# EAGLE design solohm (EAGLE 6.6.0)

## Sheet 1 of 4: CPU
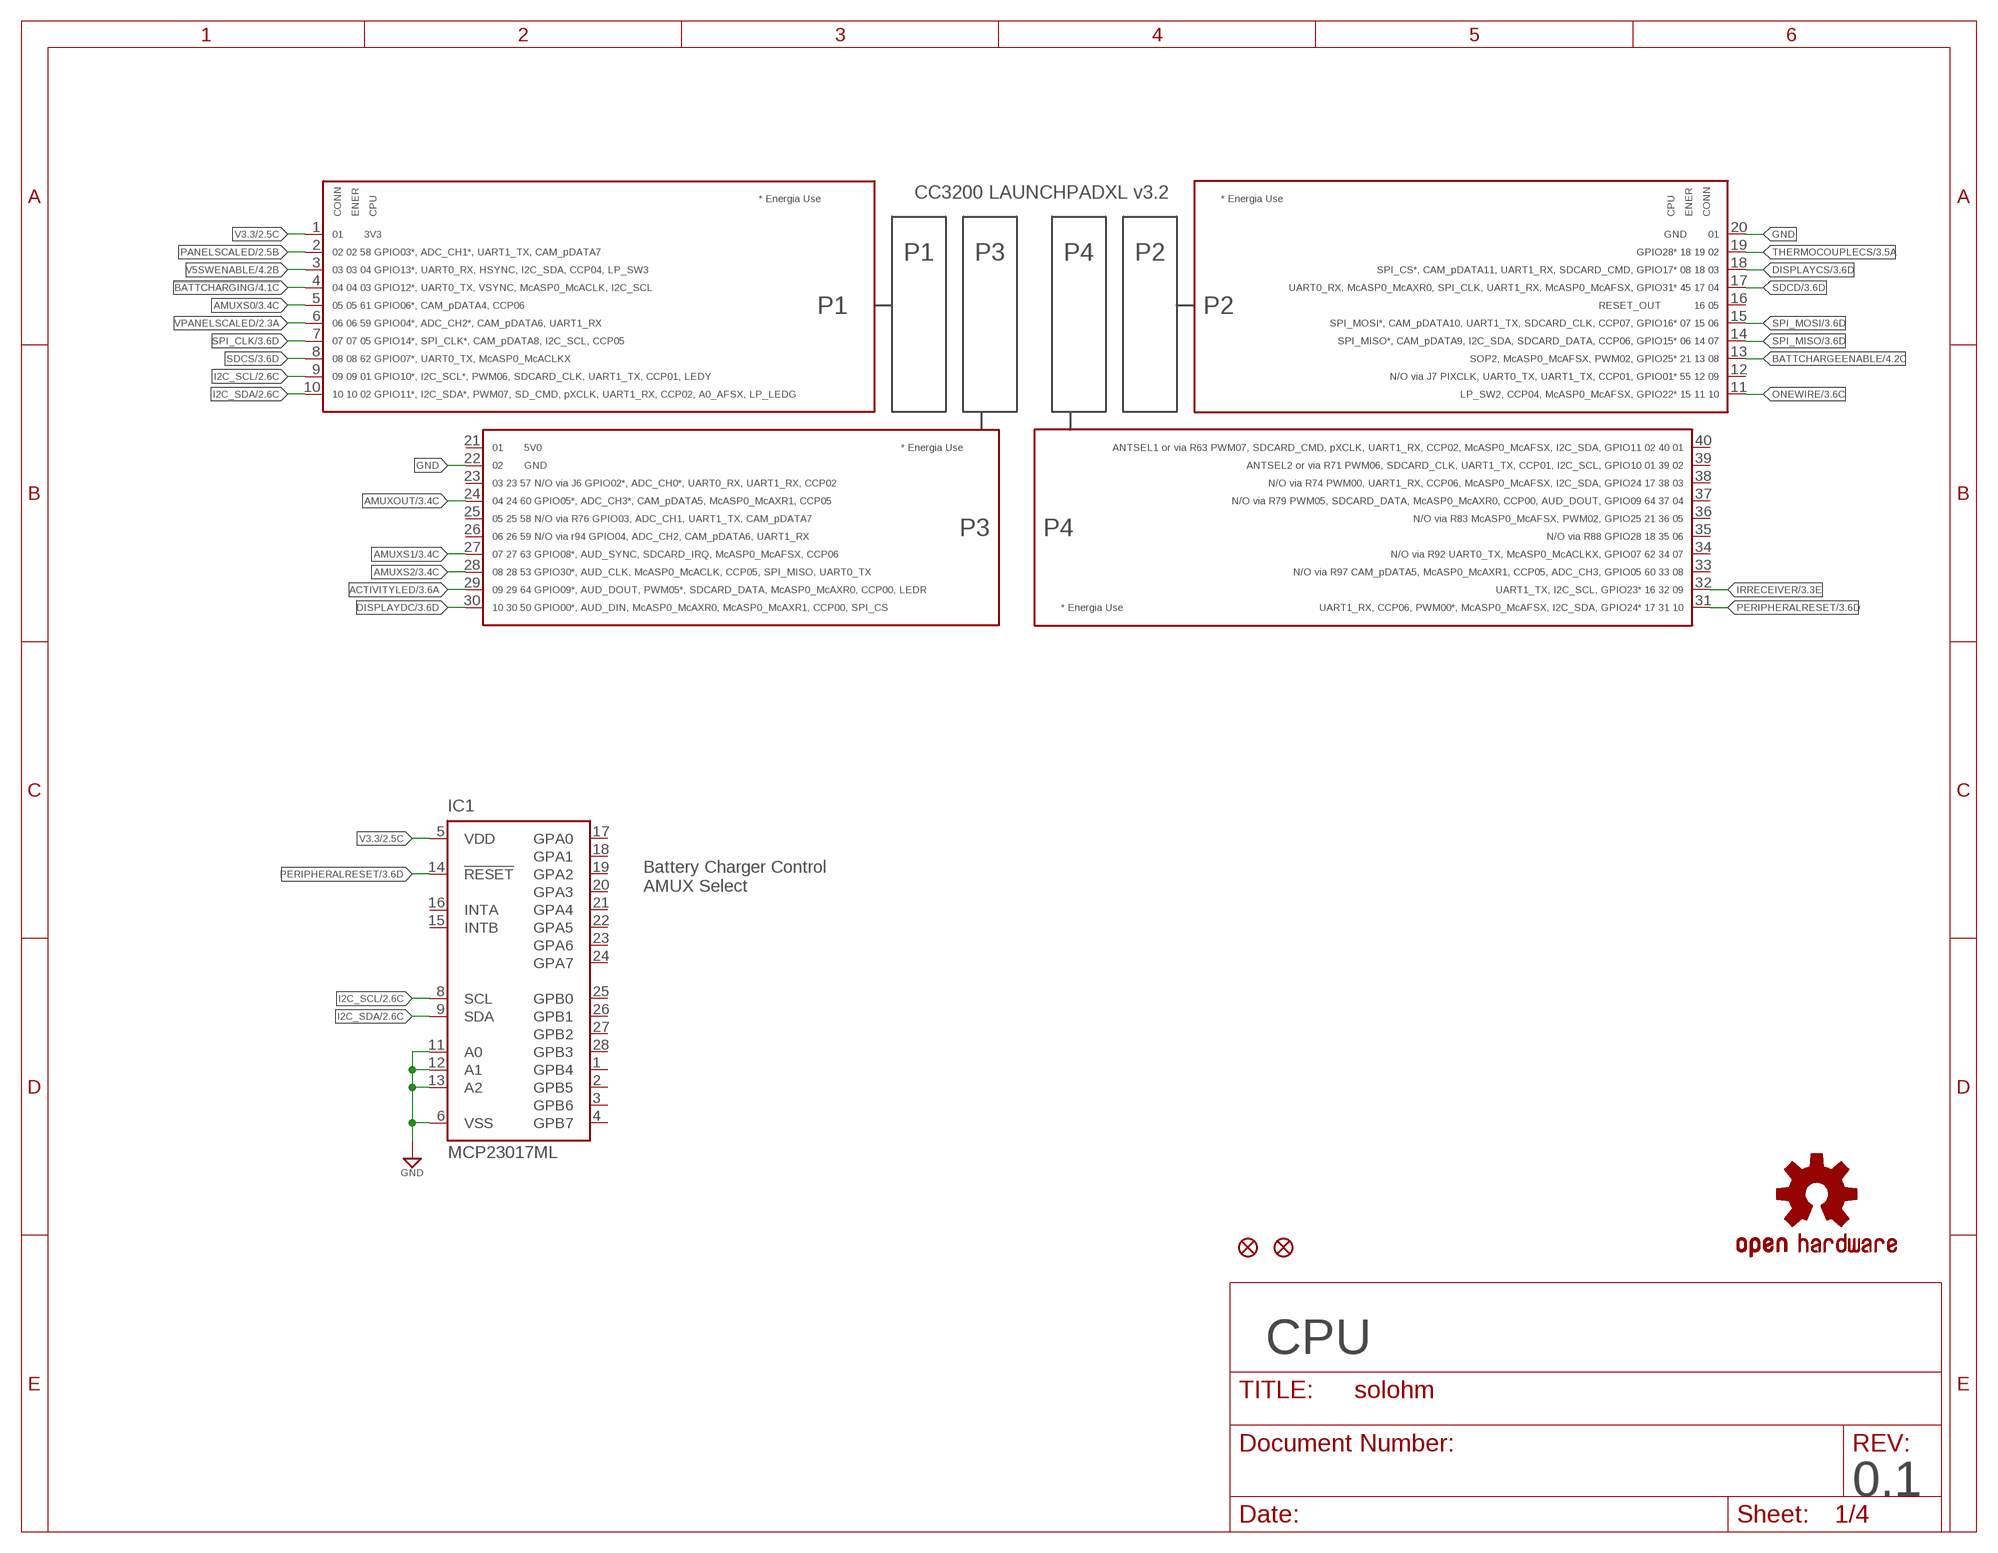
[diagram p0: schematic, sheet 1]

### Parts
A1  CC3200-LAUNCHXL-BOOSTERPACK  [CC3200-LAUNCHXL-BOOSTERPACK]
IC1  MCP23017ML  [QFN28-ML_6X6MM]
JP1  FIDUCIALUFIDUCIAL  [MICRO-FIDUCIAL]
JP2  FIDUCIALUFIDUCIAL  [MICRO-FIDUCIAL]
LOGO1  LOGO-OSHWL  [LOGO-OSHW-L]

### Nets
!BATTCHARGING: A1.4 ; also sheet 4
ACTIVITYLED: A1.29 ; also sheet 3
AMUXOUT: A1.24 ; also sheet 3
AMUXS0: A1.5 ; also sheet 3
AMUXS1: A1.27 ; also sheet 3
AMUXS2: A1.28 ; also sheet 3
BATTCHARGEENABLE: A1.13 ; also sheet 4
DISPLAYCS: A1.18 ; also sheet 3
DISPLAYDC: A1.30 ; also sheet 3
GND: A1.20 A1.22 IC1.6(VSS) IC1.11(A0) IC1.12(A1) IC1.13(A2) ; also sheet 2,3,4
I2C_SCL: A1.9 IC1.8(SCL) ; also sheet 2,3
I2C_SDA: A1.10 IC1.9(SDA) ; also sheet 2,3
IPANELSCALED: A1.2 ; also sheet 2
IRRECEIVER: A1.32 ; also sheet 3
ONEWIRE: A1.11 ; also sheet 3
PERIPHERALRESET: A1.31 IC1.14(!RESET) ; also sheet 3
SDCD: A1.17 ; also sheet 3
SDCS: A1.8 ; also sheet 3
SPI_CLK: A1.7 ; also sheet 3
SPI_MISO: A1.14 ; also sheet 3
SPI_MOSI: A1.15 ; also sheet 3
THERMOCOUPLECS: A1.19 ; also sheet 3
V3.3: A1.1 IC1.5(VDD) ; also sheet 2,3,4
V5SWENABLE: A1.3 ; also sheet 4
VPANELSCALED: A1.6 ; also sheet 2
Unconnected: A1.12 A1.16 A1.21 A1.23 A1.25 A1.26 A1.33 A1.34 A1.35 A1.36 A1.37 A1.38 A1.39 A1.40 IC1.1(GPB4) IC1.2(GPB5) IC1.3(GPB6) IC1.4(GPB7) IC1.15(INTB) IC1.16(INTA) IC1.17(GPA0) IC1.18(GPA1) IC1.19(GPA2) IC1.20(GPA3) IC1.21(GPA4) IC1.22(GPA5) IC1.23(GPA6) IC1.24(GPA7) IC1.25(GPB0) IC1.26(GPB1) IC1.27(GPB2) IC1.28(GPB3)

### Notes on the sheet
- Battery Charger Control
  AMUX Select
- CPU
- 0.1

## Sheet 2 of 4: Load and Gain
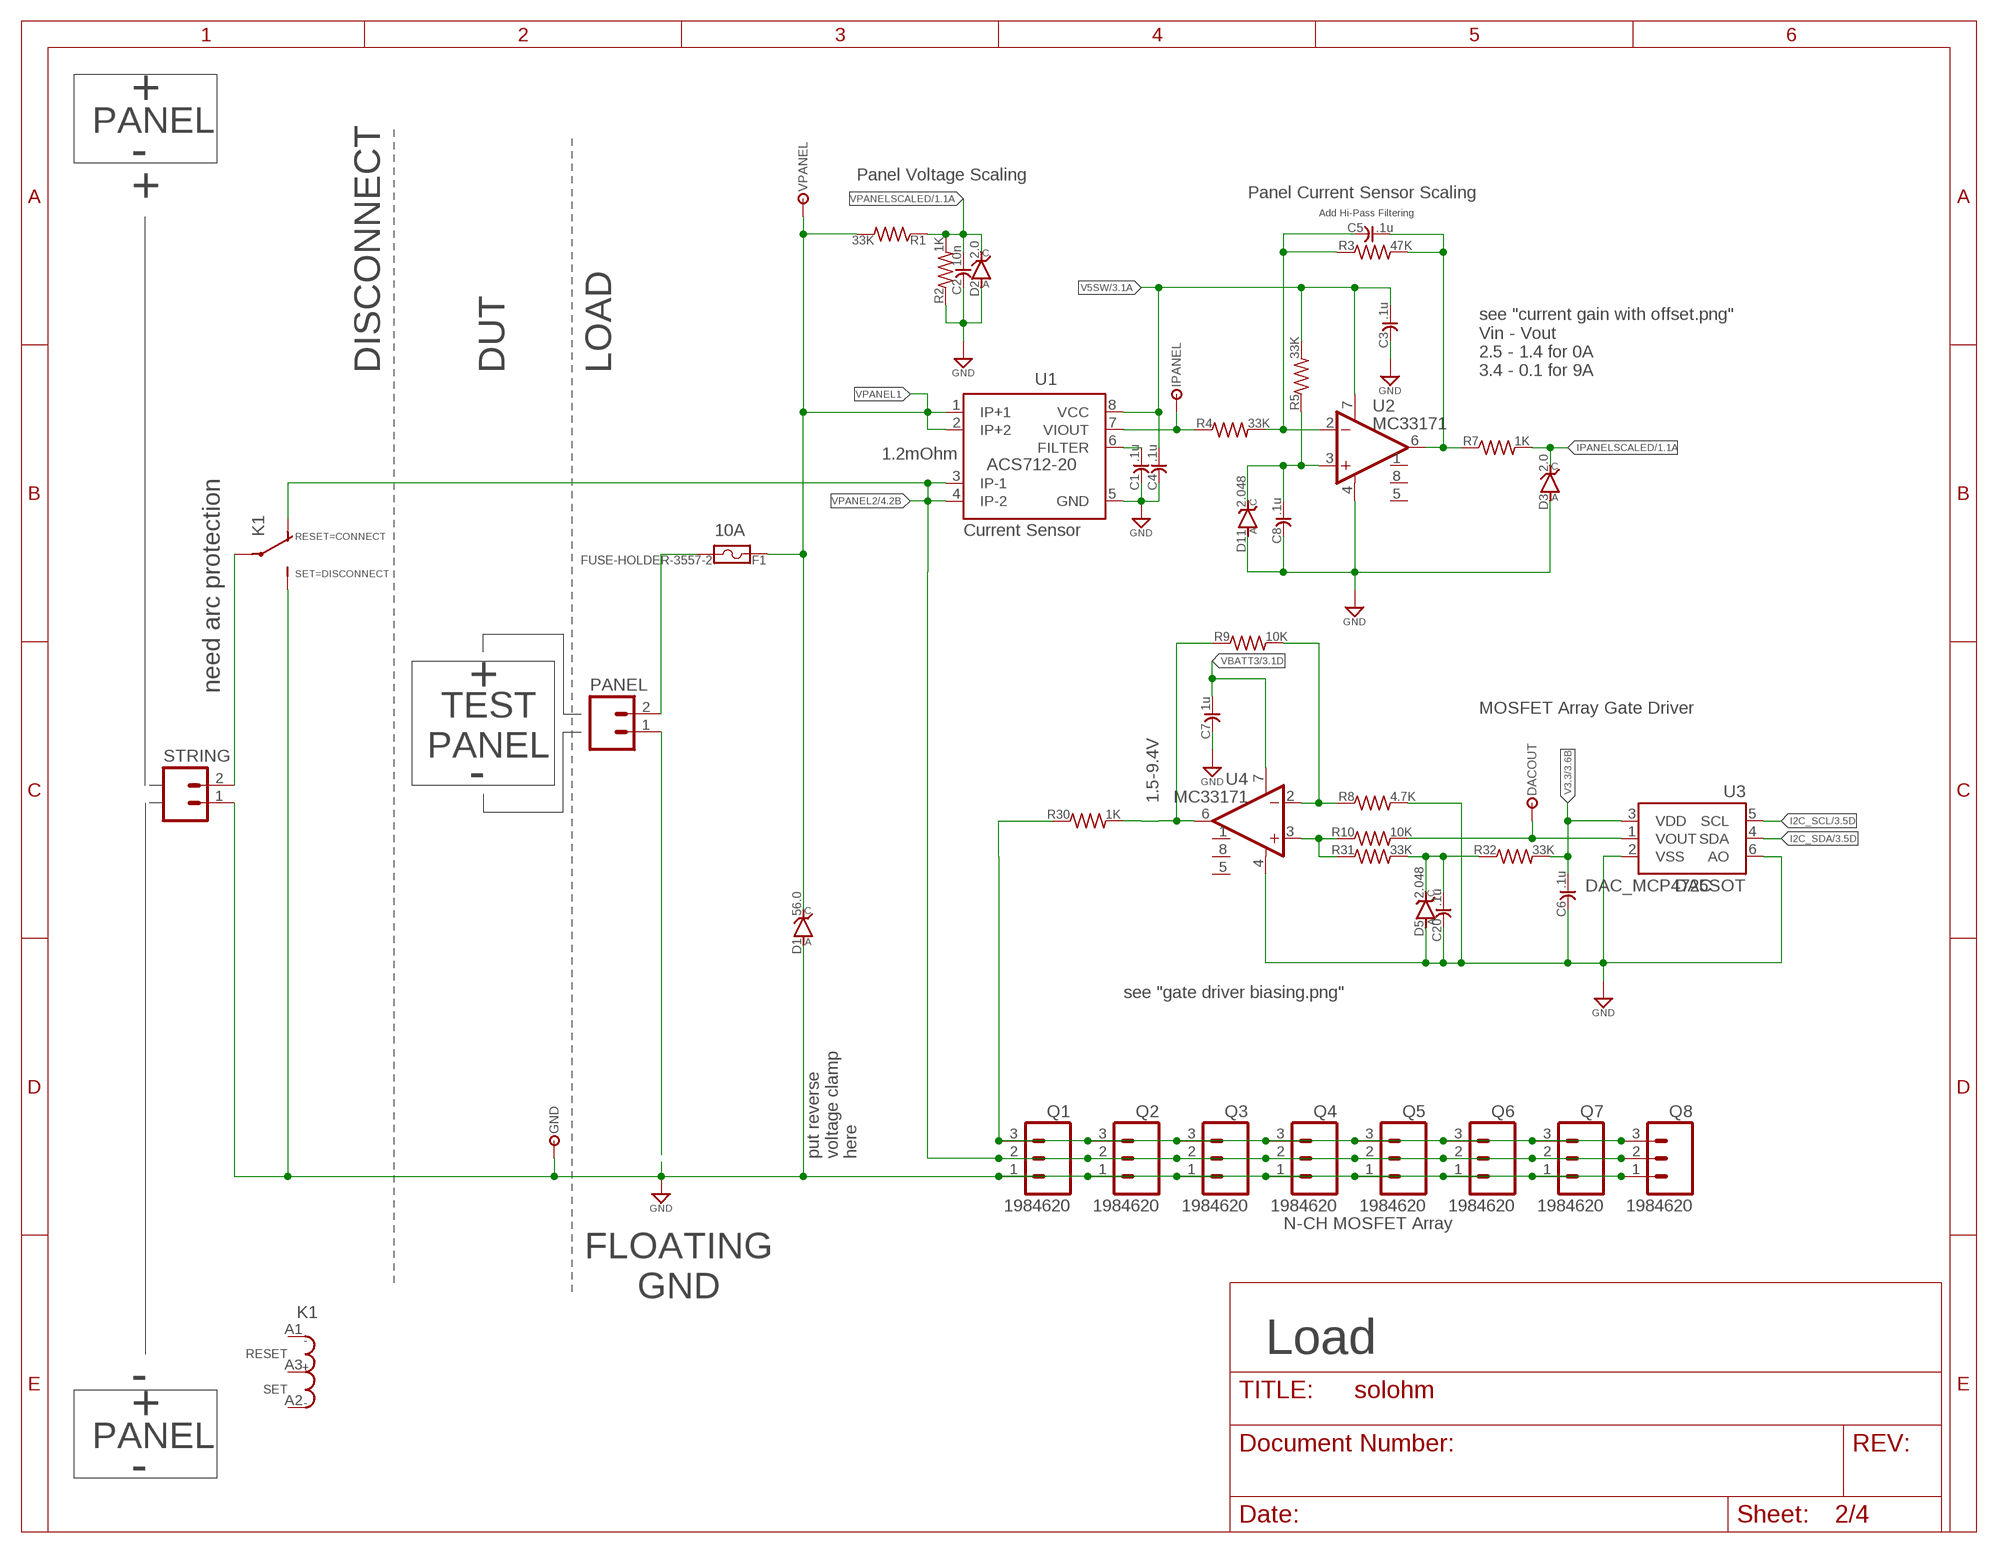
[diagram p1: schematic, sheet 2]

### Parts
C1  .1u  C-USC0603  [C0603]
C2  10n  C-USC0603  [C0603]
C3  .1u  C-USC0603  [C0603]
C4  .1u  C-USC0603  [C0603]
C5  .1u  C-USC0603  [C0603]
C6  .1u  C-USC0603  [C0603]
C7  1u  C-USC0603  [C0603]
C8  .1u  C-USC0603  [C0603]
C20  .1u  C-USC0603  [C0603]
D1  56.0  ZENER-SOD323  [SOD-323]
D2  2.0  ZENER-SOD323  [SOD-323]
D3  2.0  ZENER-SOD323  [SOD-323]
D5  2.048  ZENER-3TERM-SOT23-3  [SOT23-3]
D11  2.048  ZENER-3TERM-SOT23-3  [SOT23-3]
DACOUT  TESTPOINTTHRU  [TPTHRU]
F1  FUSE-HOLDER-3557-2  [3557-2]
GND  TESTPOINTTHRU  [TPTHRU]
IPANEL  TESTPOINTTHRU  [TPTHRU]
K1  RELAY-LATCHING-DUAL-1FORMC-5MM-16A  [RELAY-1FORMC-5MM-16A]
PANEL  M02-6.35MM  [OSTT702]
Q1  1984620  [1984620]
Q2  1984620  [1984620]
Q3  1984620  [1984620]
Q4  1984620  [1984620]
Q5  1984620  [1984620]
Q6  1984620  [1984620]
Q7  1984620  [1984620]
Q8  1984620  [1984620]
R1  33K  R-US_R0603  [R0603]
R2  1K  R-US_R0603  [R0603]
R3  47K  R-US_R0603  [R0603]
R4  33K  R-US_R0603  [R0603]
R5  33K  R-US_R0603  [R0603]
R7  1K  R-US_R0603  [R0603]
R8  4.7K  R-US_R0603  [R0603]
R9  10K  R-US_R0603  [R0603]
R10  10K  R-US_R0603  [R0603]
R30  1K  R-US_R0603  [R0603]
R31  33K  R-US_R0603  [R0603]
R32  33K  R-US_R0603  [R0603]
STRING  M02-6.35MM  [OSTT702]
U1  20  ACS712  [SOIC08]
U2  MC33171  OPAMPLM-SO08  [SO08]
U3  DAC_MCP4725SOT  [SOT23-6]
U4  MC33171  OPAMPLM-SO08  [SO08]
VPANEL  TESTPOINTTHRU  [TPTHRU]

### Nets
GATES: Q1.3 Q2.3 Q3.3 Q4.3 Q5.3 Q6.3 Q7.3 Q8.3 R30.1
GND: C1.2 C2.2 C3.2 C4.2 C6.2 C7.2 C8.2 C20.2 D1.A D2.A D3.A D5.2(A) D11.2(A) GND.1 K1.14@1(-1:NO) K1.14@2(-1:NO) PANEL.1 Q1.1 Q2.1 Q3.1 Q4.1 Q5.1 Q6.1 Q7.1 Q8.1 R2.1 R8.2 STRING.1 U1.5(GND) U2.4(V-) U3.2(VSS) U3.6(AO) U4.4(V-) ; also sheet 1,3,4
I2C_SCL: U3.5(SCL) ; also sheet 1,3
I2C_SDA: U3.4(SDA) ; also sheet 1,3
IPANELSCALED: D3.C R7.2 ; also sheet 1
N$1: R9.1 R30.2 U4.6(OUT)
N$3: C20.1 D5.1(C) R31.2 R32.1
N$4: C1.1 U1.6(FILTER)
N$5: IPANEL.1 R4.1 U1.7(VIOUT)
N$6: C5.2 R3.1 R4.2 U2.2(IN-)
N$7: C8.1 D11.1(C) R5.1 U2.3(IN+)
N$8: C5.1 R3.2 R7.1 U2.6(OUT)
N$9: DACOUT.1 R10.2 U3.1(VOUT)
N$10: R8.1 R9.2 U4.2(IN-)
N$12: R10.1 R31.1 U4.3(IN+)
N$20: K1.11@1(-1:W) K1.11@2(-1:W) STRING.2
V3.3: C6.1 R32.2 U3.3(VDD) ; also sheet 1,3,4
V5SW: C3.1 C4.1 R5.2 U1.8(VCC) U2.7(V+) ; also sheet 3,4
VBATT3: C7.1 U4.7(V+) ; also sheet 3,4
VPANEL0: F1.2@1 F1.2@2 PANEL.2
VPANEL1: D1.C F1.1@1 F1.1@2 R1.2 U1.1(IP+1) U1.2(IP+2) VPANEL.1
VPANEL2: K1.12@1(-1:NC) K1.12@2(-1:NC) Q1.2 Q2.2 Q3.2 Q4.2 Q5.2 Q6.2 Q7.2 Q8.2 U1.3(IP-1) U1.4(IP-2) ; also sheet 4
VPANELSCALED: C2.1 D2.C R1.1 R2.2 ; also sheet 1
Unconnected: D5.3(NC) D11.3(NC) K1.A1 K1.A2 K1.A3 U2.1(ON1) U2.5(NC8) U2.8(ON5) U4.1(ON1) U4.5(NC8) U4.8(ON5)

### Notes on the sheet
- +
- PANEL
- -
- Panel Voltage Scaling
- + | Panel Current Sensor Scaling
- Add Hi-Pass Filtering
- DISCONNECT | DUT | LOAD
- see "current gain with offset.png"
  Vin - Vout
  2.5 - 1.4 for 0A
  3.4 - 0.1 for 9A
- 1.2mOhm
- 10A | Current Sensor
- RESET=CONNECT
- SET=DISCONNECT
- need arc protection | +
- MOSFET Array Gate Driver
- TEST
  PANEL
- -
- 1.5-9.4V
- DAC
- see "gate driver biasing.png"
- put reverse 
  voltage clamp
  here
- N-CH MOSFET Array
- FLOATING
  GND
- Load
- -
- +
- PANEL
- -

## Sheet 3 of 4: Sensors and UI
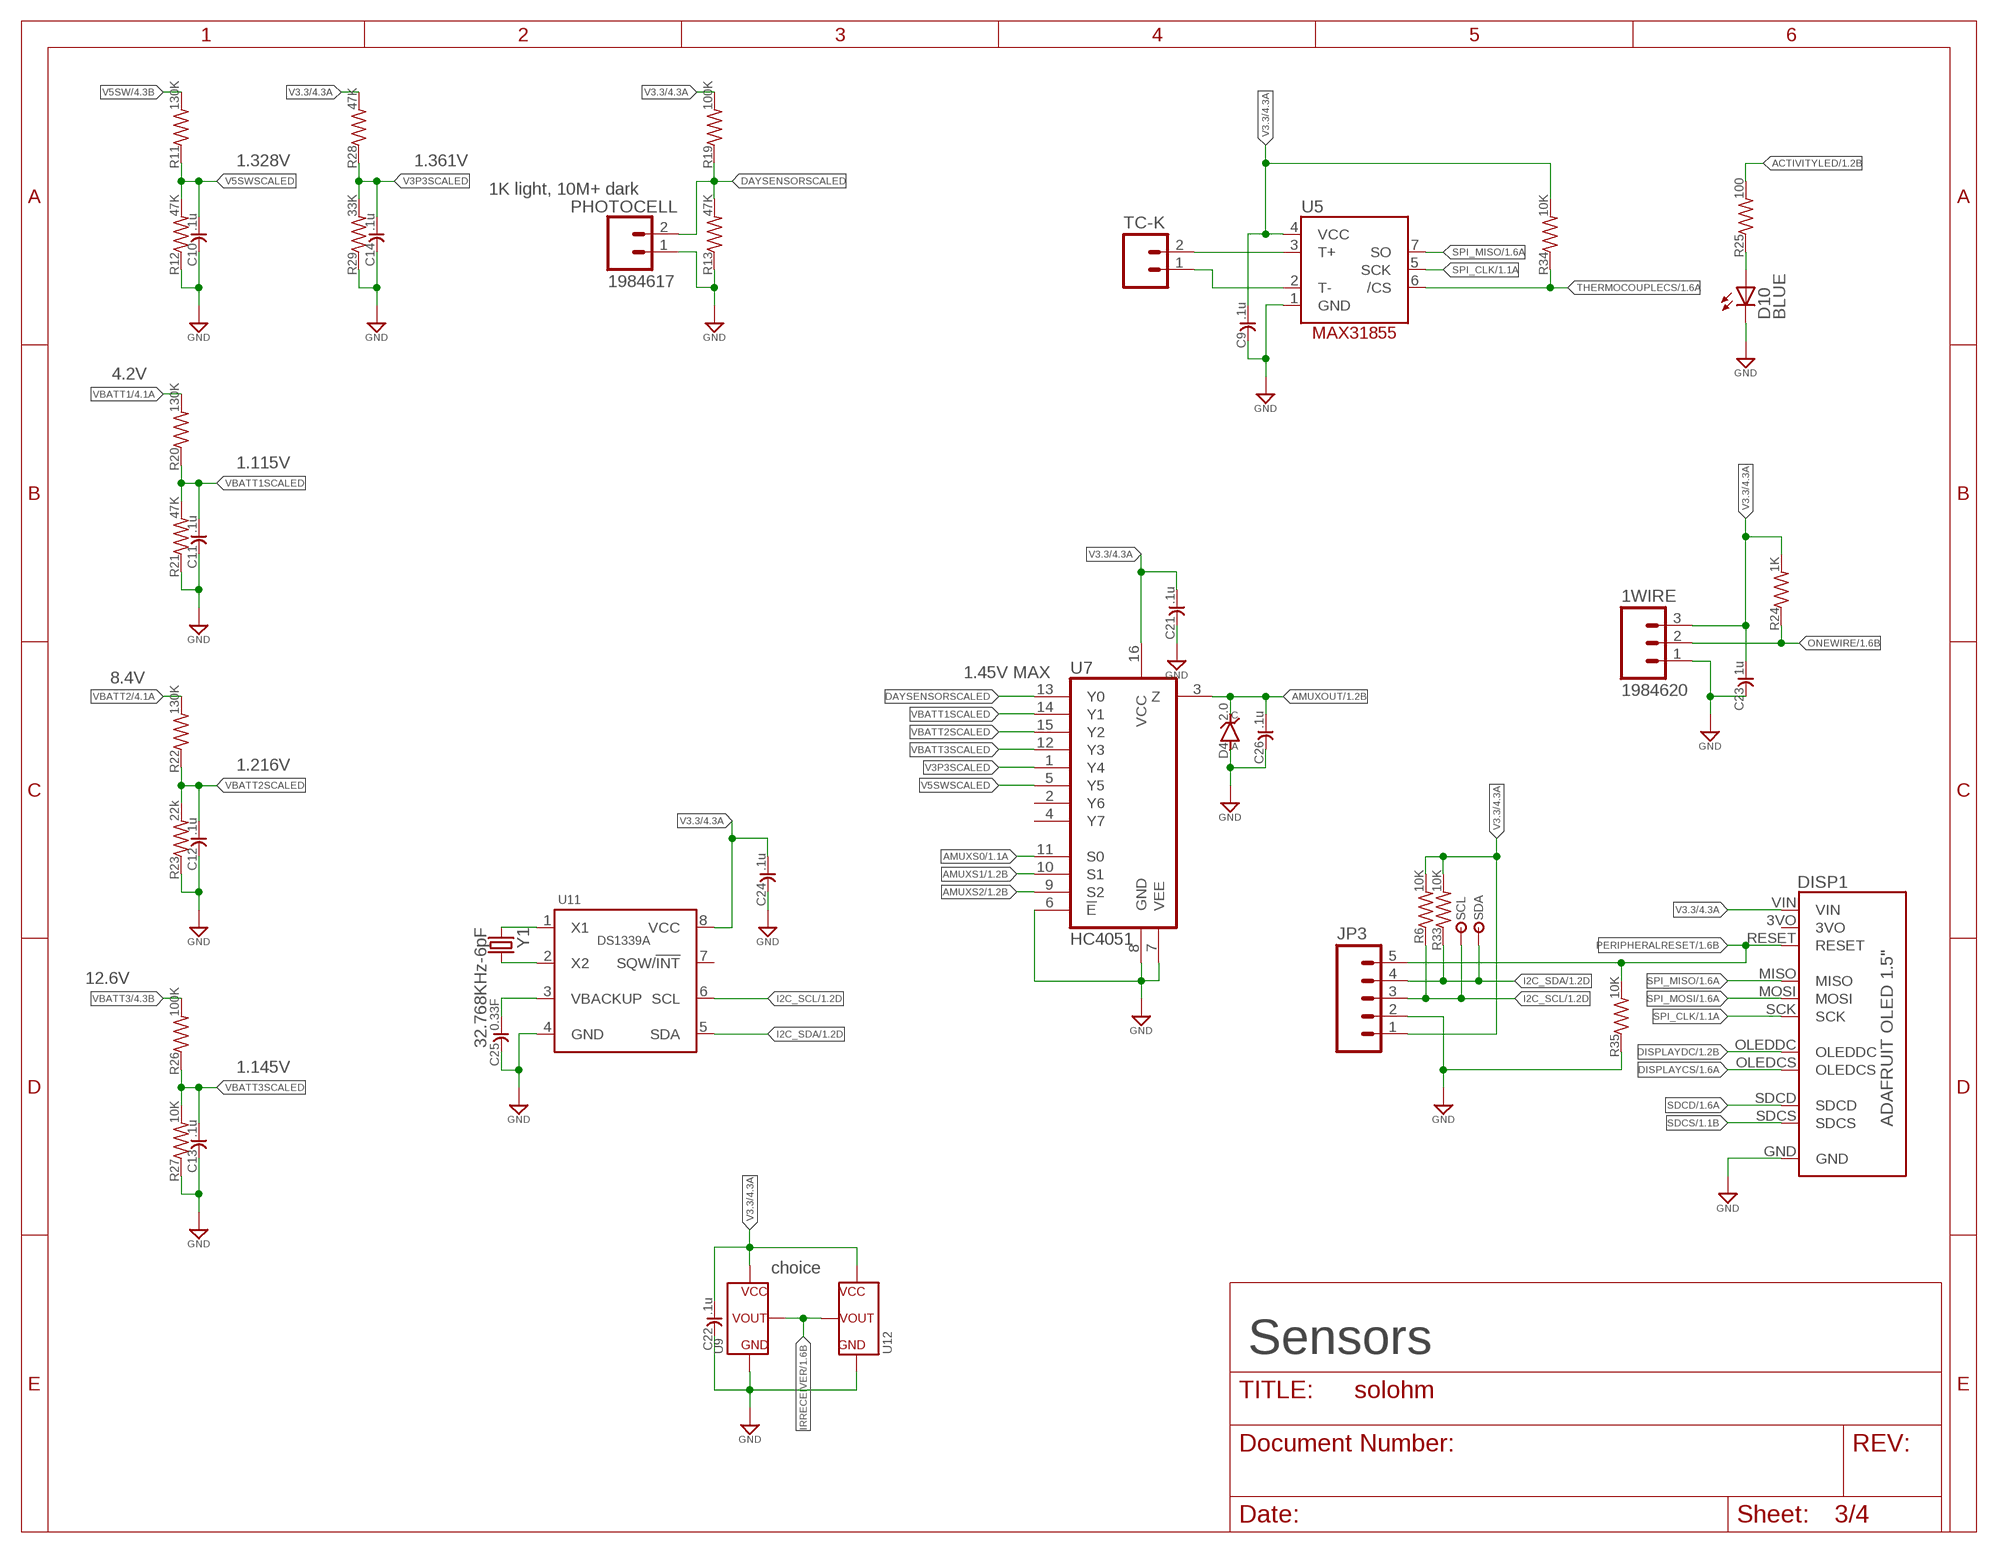
[diagram p2: schematic, sheet 3]

### Parts
1WIRE  1984620  [1984620]
C9  .1u  C-USC0603  [C0603]
C10  .1u  C-USC0603  [C0603]
C11  .1u  C-USC0603  [C0603]
C12  .1u  C-USC0603  [C0603]
C13  .1u  C-USC0603  [C0603]
C14  .1u  C-USC0603  [C0603]
C21  .1u  C-USC0603  [C0603]
C22  .1u  C-USC0603  [C0603]
C23  1u  C-USC0603  [C0603]
C24  .1u  C-USC0603  [C0603]
C25  0.33F  C-SUPER-10MM  [CAP-SUPER-AXIAL-10MM]
C26  .1u  C-USC0603  [C0603]
D4  2.0  ZENER-SOD323  [SOD-323]
D10  BLUE  LED-0805  [LED0805]
DISP1  BOARD-DISP-ADAFRUIT-OLED-1.5  [BOARD-DISP-ADAFRUIT-OLED-1.5]
JP3  M05PTH  [1X05]
PHOTOCELL  1984617  [1984617]
R6  10K  R-US_R0603  [R0603]
R11  130K  R-US_R0603  [R0603]
R12  47K  R-US_R0603  [R0603]
R13  47K  R-US_R0603  [R0603]
R19  100K  R-US_R0603  [R0603]
R20  130K  R-US_R0603  [R0603]
R21  47K  R-US_R0603  [R0603]
R22  130K  R-US_R0603  [R0603]
R23  22k  R-US_R0603  [R0603]
R24  1K  R-US_R0603  [R0603]
R25  100  R-US_R0603  [R0603]
R26  100K  R-US_R0603  [R0603]
R27  10K  R-US_R0603  [R0603]
R28  47K  R-US_R0603  [R0603]
R29  33K  R-US_R0603  [R0603]
R33  10K  R-US_R0603  [R0603]
R34  10K  R-US_R0603  [R0603]
R35  10K  R-US_R0603  [R0603]
SCL  TESTPOINTTHRU  [TPTHRU]
SDA  TESTPOINTTHRU  [TPTHRU]
TC-K  M02-1984617  [1984617]
U5  THERMOCOUPLE-MAX31855  [SO08]
U7  HC4051  [SO16]
U9  IRDETECTOR-THRU  [IRDETECTOR-THRU]
U11  RTC-DS1339A  [MSOP8]
U12  IRDETECTOR-TSOP6X  [IRDETECTOR-TSOP6X]
Y1  32.768KHz-6pF  CRYSTAL32-SMDABS25  [ABS25]

### Nets
ACTIVITYLED: R25.2 ; also sheet 1
AMUXOUT: C26.1 D4.C U7.3(Z) ; also sheet 1
AMUXS0: U7.11(S0) ; also sheet 1
AMUXS1: U7.10(S1) ; also sheet 1
AMUXS2: U7.9(S2) ; also sheet 1
DAYSENSORSCALED: PHOTOCELL.2 R13.2 R19.1 U7.13(Y0)
DISPLAYCS: DISP1.OLEDCS ; also sheet 1
DISPLAYDC: DISP1.OLEDDC ; also sheet 1
GND: 1WIRE.1 C9.2 C10.2 C11.2 C12.2 C13.2 C14.2 C21.2 C22.2 C23.2 C24.2 C25.- C26.2 D4.A D10.C DISP1.GND JP3.2 PHOTOCELL.1 R12.1 R13.1 R21.1 R23.1 R27.1 R29.1 R35.1 U5.1(GND) U7.6(!E) U7.7(VEE) U7.8(GND) U9.GND U11.4(GND) U12.GND ; also sheet 1,2,4
I2C_SCL: JP3.3 R6.1 SCL.1 U11.6(SCL) ; also sheet 1,2
I2C_SDA: JP3.4 R33.1 SDA.1 U11.5(SDA) ; also sheet 1,2
IRRECEIVER: U9.VOUT U12.OUT(VOUT) ; also sheet 1
N$2: TC-K.2 U5.3(T+)
N$11: TC-K.1 U5.2(T-)
N$13: U11.1(X1) Y1.1
N$17: U11.2(X2) Y1.4
N$18: C25.+ U11.3(VBACKUP)
N$19: D10.A R25.1
ONEWIRE: 1WIRE.2 R24.1 ; also sheet 1
PERIPHERALRESET: DISP1.RESET JP3.5 R35.2 ; also sheet 1
SDCD: DISP1.SDCD ; also sheet 1
SDCS: DISP1.SDCS ; also sheet 1
SPI_CLK: DISP1.SCK U5.5(SCK) ; also sheet 1
SPI_MISO: DISP1.MISO U5.7(SO) ; also sheet 1
SPI_MOSI: DISP1.MOSI ; also sheet 1
THERMOCOUPLECS: R34.1 U5.6(/CS) ; also sheet 1
V3.3: 1WIRE.3 C9.1 C21.1 C22.1 C23.1 C24.1 DISP1.VIN JP3.1 R6.2 R19.2 R24.2 R28.2 R33.2 R34.2 U5.4(VCC) U7.16(VCC) U9.VCC U11.8(VCC) U12.VCC ; also sheet 1,2,4
V3P3SCALED: C14.1 R28.1 R29.2 U7.1(Y4)
V5SW: R11.2 ; also sheet 2,4
V5SWSCALED: C10.1 R11.1 R12.2 U7.5(Y5)
VBATT1: R20.2 ; also sheet 4
VBATT1SCALED: C11.1 R20.1 R21.2 U7.14(Y1)
VBATT2: R22.2 ; also sheet 4
VBATT2SCALED: C12.1 R22.1 R23.2 U7.15(Y2)
VBATT3: R26.2 ; also sheet 2,4
VBATT3SCALED: C13.1 R26.1 R27.2 U7.12(Y3)
Unconnected: DISP1.3VO U5.8(NC) U7.2(Y6) U7.4(Y7) U11.7(SQW/!INT)

### Notes on the sheet
- 1.328V | 1.361V
- 1K light, 10M+ dark
- 4.2V
- 1.115V
- 1.45V MAX
- 8.4V
- 1.216V
- 12.6V
- 1.145V
- choice
- Sensors

## Sheet 4 of 4: Power Supply
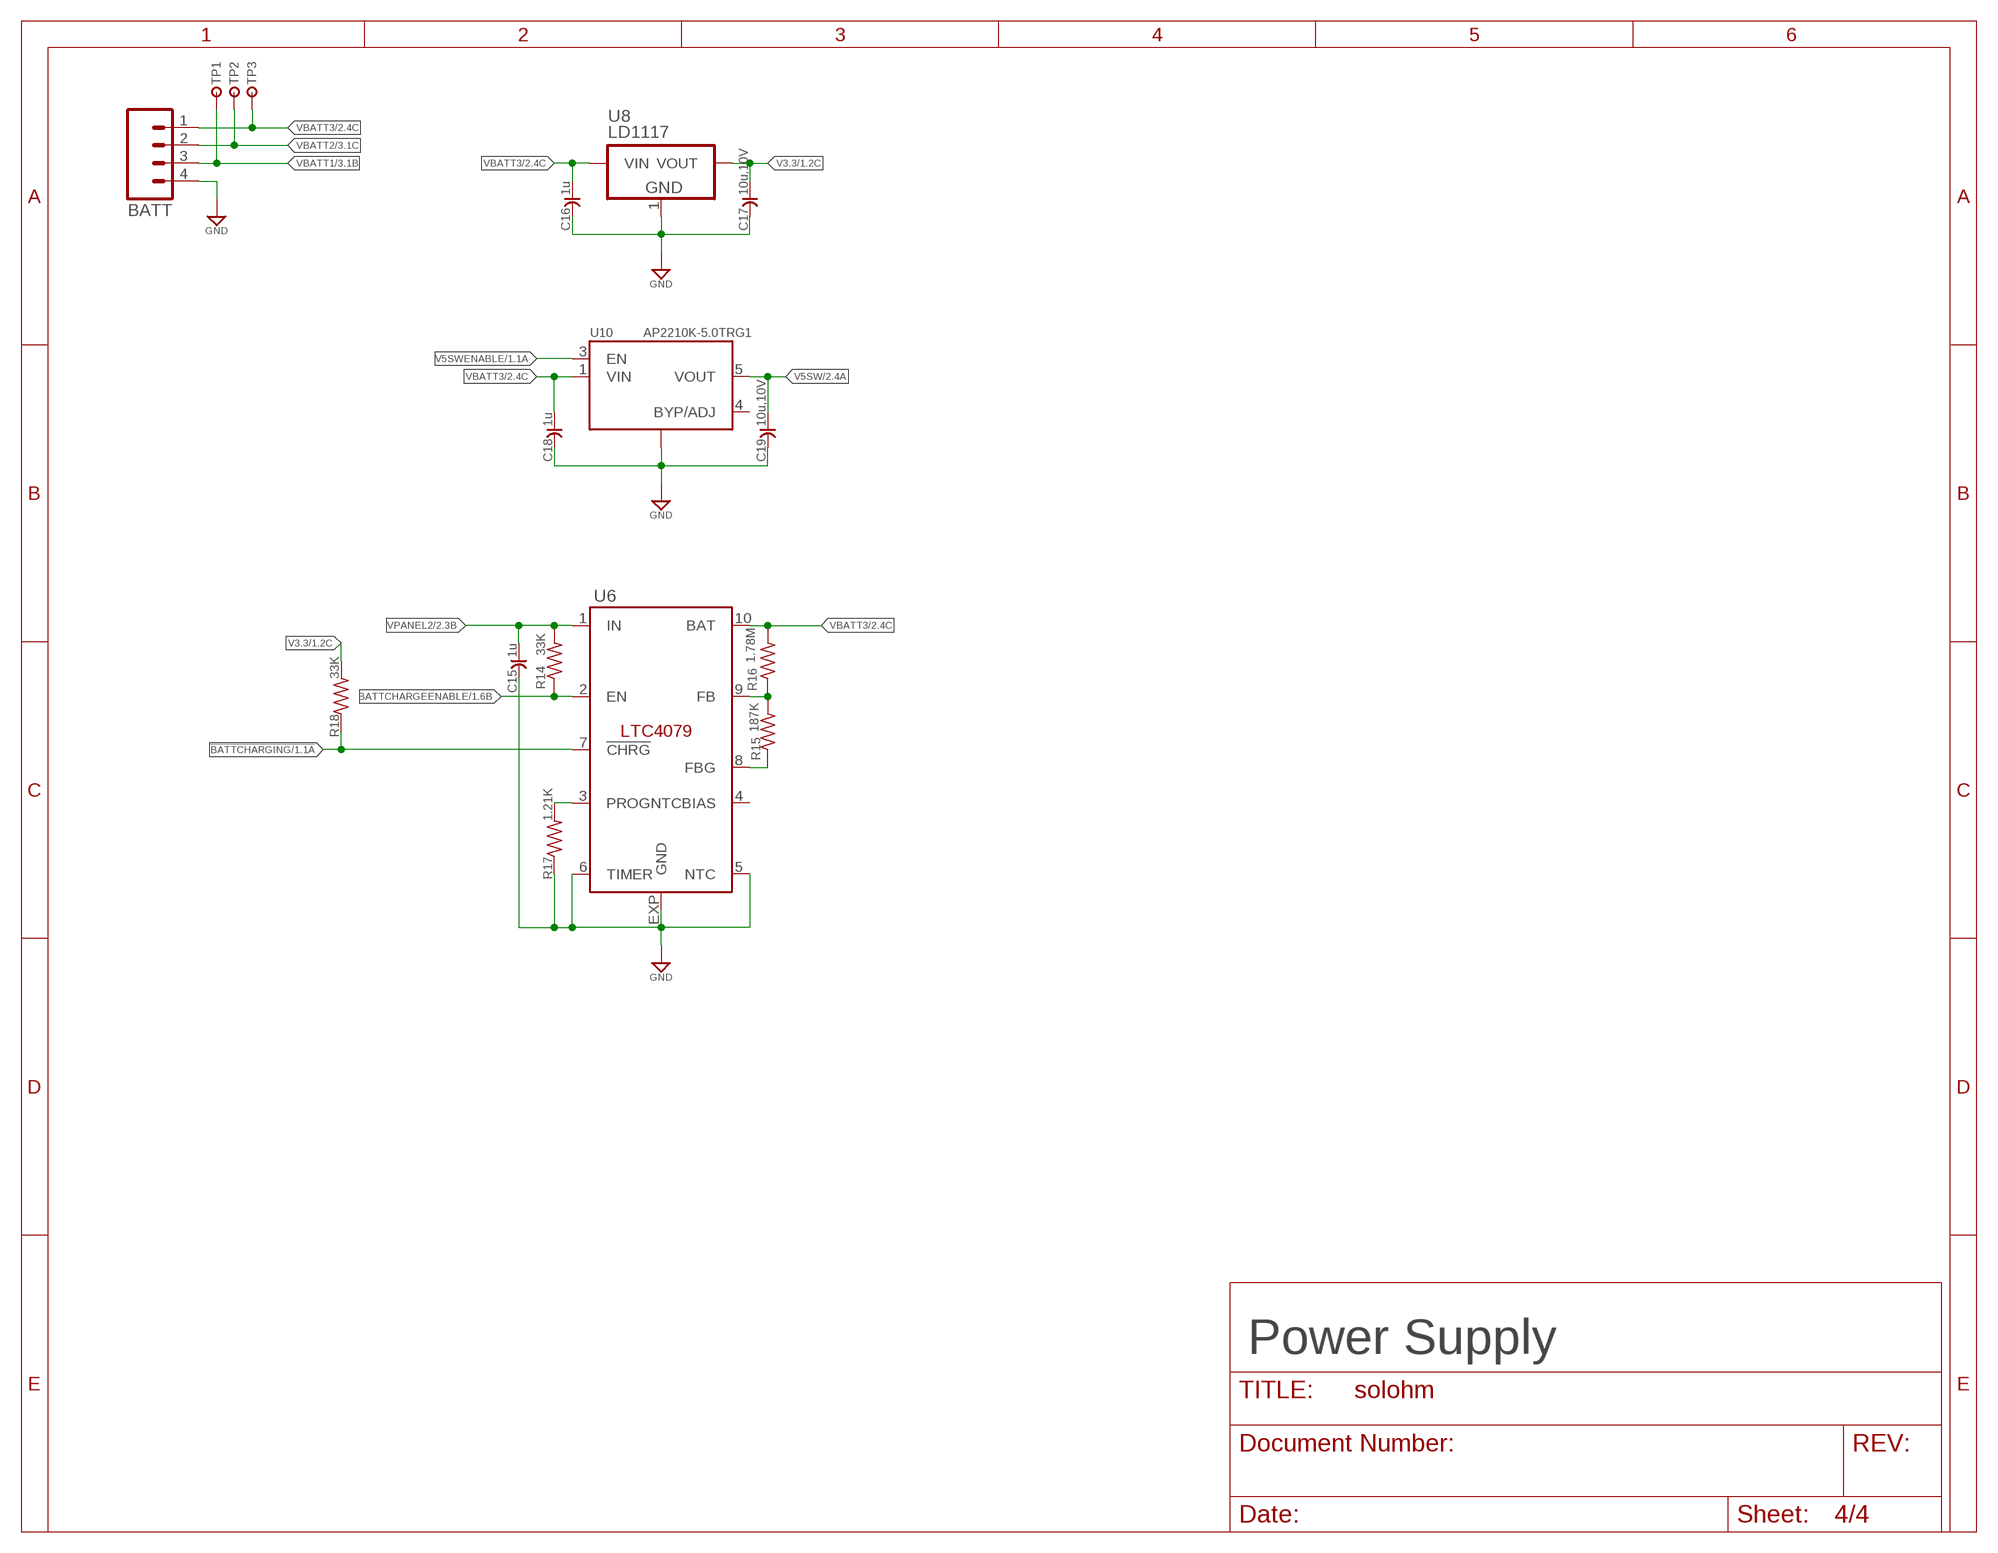
[diagram p3: schematic, sheet 4]

### Parts
BATT  M04-B4B-XH-VERT  [JST-B4B-XH-VERT]
C15  1u  C-USC0603  [C0603]
C16  1u  C-USC0603  [C0603]
C17  10u,10V  C-USC0805  [C0805]
C18  1u  C-USC0603  [C0603]
C19  10u,10V  C-USC0805  [C0805]
R14  33K  R-US_R0603  [R0603]
R15  187K  R-US_R0603  [R0603]
R16  1.78M  R-US_R0603  [R0603]
R17  1.21K  R-US_R0603  [R0603]
R18  33K  R-US_R0603  [R0603]
TP1  TESTPOINT0.5  [TP0.5R]
TP2  TESTPOINT0.5  [TP0.5R]
TP3  TESTPOINT0.5  [TP0.5R]
U6  BATTCHARGER-LTC4079  [DFN10-3X3]
U8  LD1117  VOLTAGEREG-SOT-223  [SOT-223]
U10  AP2210K-5.0TRG1  VOLTAGEREG-ENABLE  [SOT23-5]

### Nets
!BATTCHARGING: R18.1 U6.7(!CHRG) ; also sheet 1
BATTCHARGEENABLE: R14.1 U6.2(EN) ; also sheet 1
GND: BATT.4 C15.2 C16.2 C17.2 C18.2 C19.2 R17.1 U6.5(NTC) U6.6(TIMER) U6.EXP(GND) U8.1(GND) U10.2(GND) ; also sheet 1,2,3
N$14: R15.2 R16.1 U6.9(FB)
N$15: R15.1 U6.8(FBG)
N$16: R17.2 U6.3(PROG)
V3.3: C17.1 R18.2 U8.2(VOUT) ; also sheet 1,2,3
V5SW: C19.1 U10.5(VOUT) ; also sheet 2,3
V5SWENABLE: U10.3(EN) ; also sheet 1
VBATT1: BATT.3 TP1.TP ; also sheet 3
VBATT2: BATT.2 TP2.TP ; also sheet 3
VBATT3: BATT.1 C16.1 C18.1 R16.2 TP3.TP U6.10(BAT) U8.3(VIN) U10.1(VIN) ; also sheet 2,3
VPANEL2: C15.1 R14.2 U6.1(IN) ; also sheet 2
Unconnected: U6.4(NTCBIAS) U10.4(BYP/ADJ)

### Notes on the sheet
- Power Supply

## Library data of the parts
1WIRE Q1-Q8 = holla:1984620: Phoenix Contact CONN TERM BLOCK T/H 3POS 3.5MM
A1 = TI-CC3200:CC3200-LAUNCHXL-BOOSTERPACK
BATT = holla:M04
C1-C26 = holla:C
D1-D4 = holla:ZENER: Zener
D5 D11 = holla:ZENER-3TERM: 3 terminal zener diode or voltage reference
D10 = holla:LED
DACOUT GND IPANEL SCL SDA TP1-TP3 VPANEL = holla:TESTPOINT; DNP: 1
DISP1 = holla:BOARD-DISP-ADAFRUIT-OLED-1.5: Adafruit OLED RGB Display 1.5" 1.5" diagonal OLED, 16-bit color SPI interface 3.3-5V logic and power Micro-SD card holder Dimensions: 43.17mm / 1.7" x 42mm / 1.65" x 5.42mm / 0.2"
F1 = holla:FUSE-HOLDER
IC1 = microchip:MCP23017: http://ww1.microchip.com/downloads/en/DeviceDoc/21952a.pdf Source: http://ww1.microchip.com/downloads/en/DeviceDoc/21952a.pdf; MF: MICROCHIP; MPN: MCP23017-E/ML; OC_FARNELL: unknown; OC_NEWARK: 31K2957
JP1 JP2 = holla:FIDUCIAL: Fiducial Alignment Points Various fiducial points for machine vision alignment.; DNP: 1
JP3 = holla:M05: Header 5 Standard 5-pin 0.1" header. Use with straight break away headers (SKU : PRT-00116), right angle break away headers (PRT-00553), swiss pins (PRT-00743), machine pins (PRT-00117), and female headers (PRT-00115). Molex polarized connector foot print use with SKU : PRT-08230 with associated crimp pins and housings.
K1 = holla:RELAY-LATCHING-DUAL: MINIATURE PC BOARD RELAY 1 Form C - 5mm 16A Source: TE RT314F12 http://www.te.com/commerce/DocumentDelivery/DDEController?Action=srchrtrv&DocNm=RT1_bistable&DocType=DS&DocLang=English; OC_FARNELL: unknown; OC_NEWARK: unknown
LOGO1 = holla:LOGO-OSHW: Open Source Hardware Logo This logo indicates the piece of hardware it is found on incorporates a OSHW license and/or adheres to the definition of open source hardware found here: http://freedomdefined.org/OSHW
PANEL STRING TC-K = holla:M02: CONN HEADER 2POS
PHOTOCELL = holla:1984617: Phoenix Contact CONN TERM BLOCK T/H 2POS 3.5MM
R1-R35 = holla:R
U1 = holla:ACS712: Fully Integrated, Hall Effect-Based Linear Current Sensor IC with 2.1 kVRMS Isolation and a Low-Resistance Current Conductor
U2 U4 = holla:OPAMP: OP AMP
U3 = holla:DAC_MCP4725: Microchip 12-bit I2C DAC, SOT23-6
U5 = holla:THERMOCOUPLE-MAX31855: MAX31855 Cold-Junction Compensated Thermocouple-to-Digital Converter The MAX31855 performs cold-junction compensation and digitizes the signal from a K-, J-, N-, T-, S-, R-, or E-type thermocouple. The data is output in a signed 14-bit, SPI-compatible, read-only format. This converter resolves temperatures to 0.25NC, allows readings as high as +1800NC and as low as -270NC, and exhibits thermo- couple accuracy of ±2NC for temperatures ranging from -200NC to +700NC for K-type thermocouples.
U6 = holla:BATTCHARGER-LTC4079: Linear LTC4079 60V, 250mA Linear Charger with Low Quiescent Current Wide Input Voltage Range: 2.7V to 60V Adjustable Battery Voltage: 1.2V to 60V Adjustable Charge Current: 10mA to 250mA Low Quiescent Current While Charging: I IN = 4μA Ultralow Battery Drain When Shutdown or Charged: I BAT < 0.01μA Auto Recharge Input Voltage Regulation for High Impedance Sources Thermal Regulation Maximizes Output Current without Overheating Constant Voltage Feedback with ±0.5% Accuracy NTC Thermistor Input for Temperature Qualified Charging Adjustable Safety Timer Charging Status Indication Thermally Enhanced 10-Lead (3mm × 3mm) DFN Package
U7 = holla:HC4051
U8 = holla:VOLTAGEREG: Various 3 pin voltage regulators in different packages Double check the right pinout for the right part
U9 U12 = holla:IRDETECTOR: IR Detector PTH equiv GP1UX311QS or TSOP38238 SMD TSOP6238TT
U10 = holla:VOLTAGEREG-ENABLE
U11 = holla:RTC-DS1339A
Y1 = holla:CRYSTAL32-SMD: 32KHz

## Board
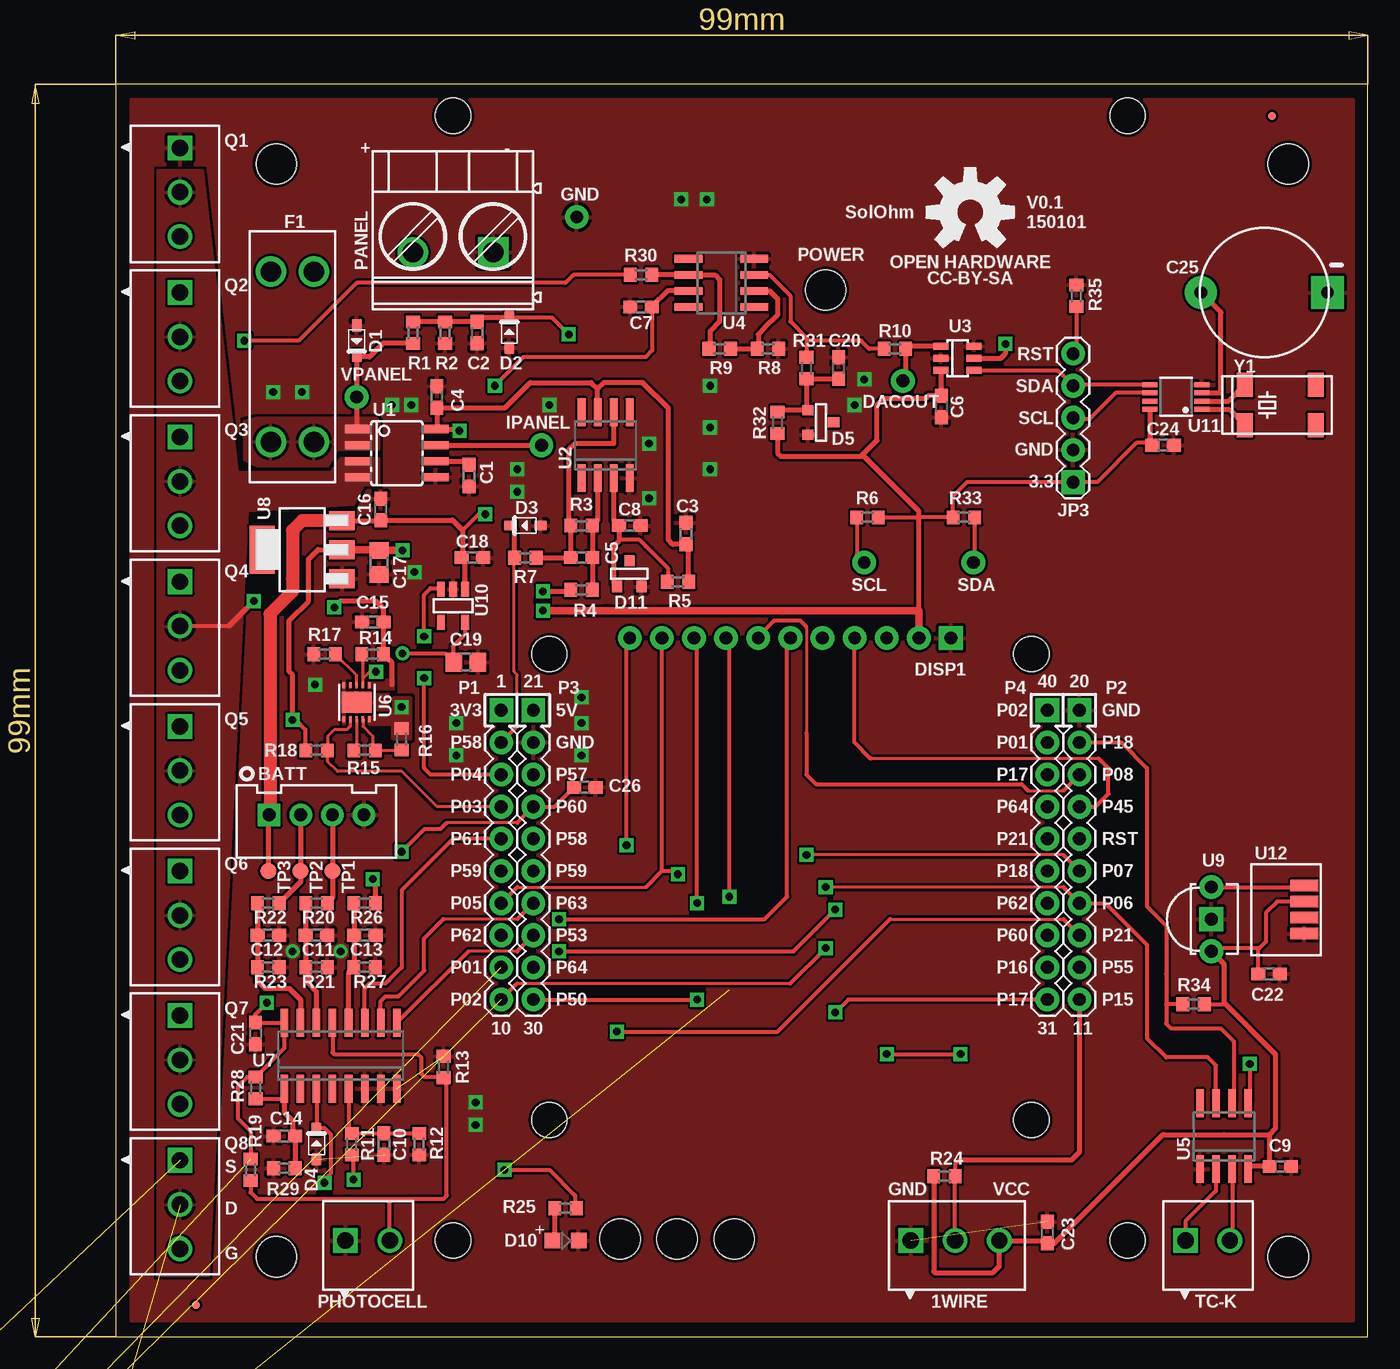
[diagram p4: board, top side]
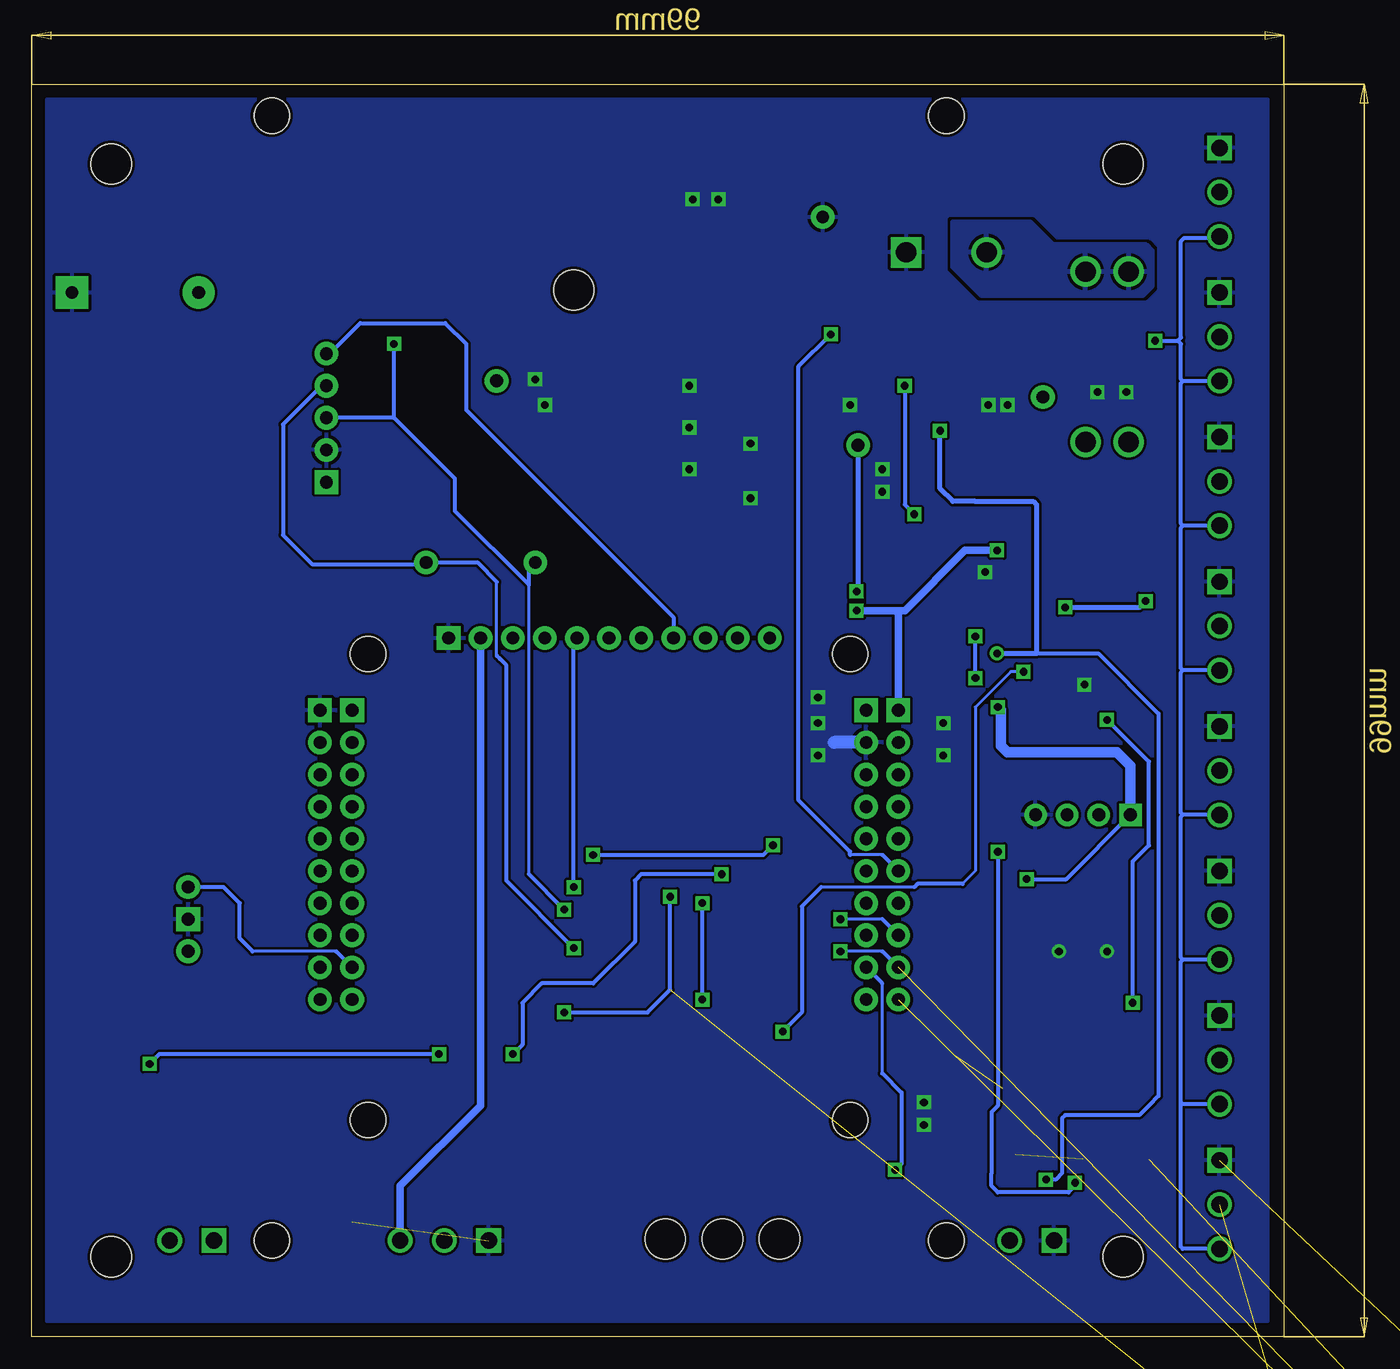
[diagram p5: board, bottom side, seen from below]

Size 99 x 99 mm. Coordinates in mm from the lower left corner, seen from the top.
Outline: 0,0 99,0 99,99 0,99 0,0
Copper layers (1*16): Top 0.035mm / dielectric 1.5mm / Bottom 0.035mm
Design rules "SparkFun": minimum track width 8mil, minimum drill 20mil, track to track 8mil, track to pad 8mil, pad to pad 8mil, via to via 8mil, smd to smd 8mil, copper to edge 10mil, drill to drill 8mil, minimum pad ring 12mil, minimum via ring 10mil, stop-mask expansion 4mil, vias tented up to drill 25mil, thermal gap 10mil
Holes 3.2 mm at 12.7,6.35 12.7,92.71 92.71,92.71 92.71,6.35 39.88,7.75 44.39,7.75 48.9,7.75 56.13,82.74

### Footprints (pad centres in the part's own frame; a part is rotated, then mirrored left to right if it is on the bottom)
1984620 = drill 1.3 square: 1 0,0 | drill 1.3: 2 3.5,0; 3 7,0
CC3200-LAUNCHXL-BOOSTERPACK = drill 1.016 pad 1.88 square: 1 -22.86,11.43; 20 22.86,11.43; 21 -20.32,11.43; 40 20.32,11.43 | drill 1.016 pad 1.88: 2 -22.86,8.89; 3 -22.86,6.35; 4 -22.86,3.81; 5 -22.86,1.27; 6 -22.86,-1.27; 7 -22.86,-3.81; 8 -22.86,-6.35; 9 -22.86,-8.89; 10 -22.86,-11.43; 11 22.86,-11.43; 12 22.86,-8.89; 13 22.86,-6.35; 14 22.86,-3.81; 15 22.86,-1.27; 16 22.86,1.27; 17 22.86,3.81; 18 22.86,6.35; 19 22.86,8.89; 22 -20.32,8.89; 23 -20.32,6.35; 24 -20.32,3.81; 25 -20.32,1.27; 26 -20.32,-1.27; 27 -20.32,-3.81; 28 -20.32,-6.35; 29 -20.32,-8.89; 30 -20.32,-11.43; 31 20.32,-11.43; 32 20.32,-8.89; 33 20.32,-6.35; 34 20.32,-3.81; 35 20.32,-1.27; 36 20.32,1.27; 37 20.32,3.81; 38 20.32,6.35; 39 20.32,8.89 | hole 2.8: -26.67,58.42; 26.67,58.42; 26.67,-30.48; -26.67,-30.48
JST-B4B-XH-VERT = drill 1 pad 1.778 square: 1 3.75,0 | drill 1 pad 1.778: 2 1.25,0; 3 -1.25,0; 4 -3.75,0
C0603 = smd 1.1 x 1: 1 -0.85,0; 2 0.85,0
C0805 = smd 1.3 x 1.5: 1 -0.95,0; 2 0.95,0
CAP-SUPER-AXIAL-10MM = drill 1.016 pad 2.54: + -5,0 | drill 1.016 pad 2.54 square: - 5,0
SOD-323 = smd 1 x 0.8: A -1.2,0; C 1.2,0
SOT23-3 = smd 0.787 x 0.889: 1 0.991,1.016; 2 -0.94,1.016; 3 0.025,-1.016
LED0805 = smd 1.2 x 1.2: A 0,-1.05; C 0,1.05
TPTHRU = drill 1.016 pad 1.88: 1 0,0
BOARD-DISP-ADAFRUIT-OLED-1.5 = drill 1.016 pad 1.88: 3VO 7.62,0; MISO 2.54,0; MOSI -12.7,0; OLEDCS -2.54,0; OLEDDC -7.62,0; RESET -5.08,0; SCK -10.16,0; SDCD 5.08,0; SDCS 0,0; VIN 10.16,0 | drill 1.016 pad 1.88 square: GND 12.7,0 | hole 2.8: -19.05,-1.27; 19.05,-1.27; 19.05,-38.1; -19.05,-38.1
3557-2 = drill 1.6: 1@1 -6.731,-1.702; 1@2 -6.731,1.702; 2@1 6.731,-1.702; 2@2 6.731,1.702
QFN28-ML_6X6MM = smd 0.7 x 0.35: 1 -2.7,1.95; 2 -2.7,1.3; 3 -2.7,0.65; 4 -2.7,0; 5 -2.7,-0.65; 6 -2.7,-1.3; 7 -2.7,-1.95; 15 2.7,-1.95; 16 2.7,-1.3; 17 2.7,-0.65; 18 2.7,0; 19 2.7,0.65; 20 2.7,1.3; 21 2.7,1.95 | smd 0.35 x 0.7: 8 -1.95,-2.7; 9 -1.3,-2.7; 10 -0.65,-2.7; 11 0,-2.7; 12 0.65,-2.7; 13 1.3,-2.7; 14 1.95,-2.7; 22 1.95,2.7; 23 1.3,2.7; 24 0.65,2.7; 25 0,2.7; 26 -0.65,2.7; 27 -1.3,2.7; 28 -1.95,2.7 | smd 3.7 x 3.7: EXP 0,0
MICRO-FIDUCIAL = smd 0.635 x 0.635: 1 0,0
1X05 = drill 1.016 pad 1.88 square: 1 0,0 | drill 1.016 pad 1.88: 2 2.54,0; 3 5.08,0; 4 7.62,0; 5 10.16,0
RELAY-1FORMC-5MM-16A = drill 1.4 pad 2: 11@1 0,3.75; 11@2 0,-3.75; 12@1 -5.04,3.75; 12@2 -5.04,-3.75; 14@1 5.04,3.75; 14@2 5.04,-3.75; A1 -20.3,3.75; A2 -20.3,-3.75; A3 -20.3,0
OSTT702 = drill 1.6 square: 1 0,0 | drill 1.6: 2 6.35,0
1984617 = drill 1.3 square: 1 0,0 | drill 1.3: 2 3.5,0
R0603 = smd 1 x 1.1: 1 -0.85,0; 2 0.85,0
TP0.5R = smd 1.27 x 1.27: TP 0,0
SOIC08 = smd 0.66 x 2.032: 1 -1.905,-3.073; 2 -0.635,-3.073; 3 0.635,-3.073; 4 1.905,-3.073; 5 1.905,3.073; 6 0.635,3.073; 7 -0.635,3.073; 8 -1.905,3.073
SO08 = smd 0.6 x 2.2: 1 -1.905,-2.6; 2 -0.635,-2.6; 3 0.635,-2.6; 4 1.905,-2.6; 5 1.905,2.6; 6 0.635,2.6; 7 -0.635,2.6; 8 -1.905,2.6
SOT23-6 = smd 0.55 x 1.2: 1 -0.95,-1.3; 2 0,-1.3; 3 0.95,-1.3; 4 0.95,1.3; 5 0,1.3; 6 -0.95,1.3
DFN10-3X3 = smd 0.25 x 0.45: 1 -1,-1.35; 2 -0.5,-1.35; 3 0,-1.35; 4 0.5,-1.35; 5 1,-1.35; 6 1,1.35; 7 0.5,1.35; 8 0,1.35; 9 -0.5,1.35; 10 -1,1.35 | smd 2.38 x 1.65: EXP 0,0
SO16 = smd 0.6 x 2.2: 1 -4.445,-2.6; 2 -3.175,-2.6; 3 -1.905,-2.6; 4 -0.635,-2.6; 5 0.635,-2.6; 6 1.905,-2.6; 7 3.175,-2.6; 8 4.445,-2.6; 9 4.445,2.6; 10 3.175,2.6; 11 1.905,2.6; 12 0.635,2.6; 13 -0.635,2.6; 14 -1.905,2.6; 15 -3.175,2.6; 16 -4.445,2.6
SOT-223 = smd 1.5 x 2: 1 -2.3,-3.15; 2 0,-3.15; 3 2.3,-3.15 | smd 3.8 x 2: 4 0,3.15
IRDETECTOR-THRU = drill 1.016 pad 1.88 square: GND 0,0 | drill 1.016 pad 1.88: VCC 2.54,0; VOUT -2.54,0
SOT23-5 = smd 0.6 x 1.2: 1 -0.95,-1.306; 2 0,-1.306; 3 0.95,-1.306; 4 0.95,1.306; 5 -0.95,1.306
MSOP8 = smd 0.4 x 1.2: 1 -0.975,-2.05; 2 -0.325,-2.05; 3 0.325,-2.05; 4 0.975,-2.05; 5 0.975,2.05; 6 0.325,2.05; 7 -0.325,2.05; 8 -0.975,2.05
IRDETECTOR-TSOP6X = smd 0.9 x 2.2: GND -1.905,0; NC -0.635,0; OUT 1.905,0; VCC 0.635,0
ABS25 = smd 1.27 x 1.905: 1 -2.794,-1.587; 2 2.794,-1.587; 3 2.794,1.587; 4 -2.794,1.587

### Placement (x,y rotation side)
1WIRE  62.87,7.62 0 top
A1  53.34,38.1 0 top
BATT  15.88,41.27 180 top
C1  27.94,68.07 270 top
C2  28.57,79.38 270 top
C3  45.09,63.5 90 top
C4  25.4,74.3 90 top
C5  36.83,61.59 0 top
C6  65.28,73.53 270 top
C7  41.53,81.41 180 top
C8  40.64,64.14 0 top
C9  92.08,13.46 0 top
C10  21.21,15.24 270 top
C11  15.88,31.75 0 top
C12  12.06,31.75 0 top
C13  19.68,31.75 0 top
C14  13.34,15.88 180 top
C15  20.32,56.52 180 top
C16  20.95,65.41 90 top
C17  20.83,61.21 270 top
C18  28.19,61.59 0 top
C19  27.69,53.34 0 top
C20  57.15,76.58 90 top
C21  11.05,24 270 top
C22  91.19,28.7 0 top
C23  73.66,8.26 90 top
C24  82.8,70.48 0 top
C25  90.81,82.55 0 top
C26  37.08,43.43 0 top
D1  19.05,78.74 270 top
D2  31.11,79.38 90 top
D3  32.38,64.14 180 top
D4  15.88,15.24 90 top
D5  55.75,72.26 90 top
D10  35.56,7.62 270 top
D11  40.64,60.33 180 top
DACOUT  62.23,75.56 270 top
DISP1  53.34,55.24 0 top
F1  13.97,77.47 90 top
GND  36.45,88.52 0 top
IC1  -27.05,-28.7 0 top  (outside the outline)
IPANEL  33.66,70.48 0 top
JP1  6.35,2.54 0 top
JP2  91.44,96.52 0 top
JP3  75.69,67.56 90 top
K1  0.13,-27.3 0 top  (outside the outline)
LOGO1  67.56,88.9 0 top
PANEL  29.84,85.72 180 top
PHOTOCELL  18.16,7.62 0 top
Q1  5.08,93.98 270 top
Q2  5.08,82.55 270 top
Q3  5.08,71.12 270 top
Q4  5.08,59.69 270 top
Q5  5.08,48.26 270 top
Q6  5.08,36.83 270 top
Q7  5.08,25.4 270 top
Q8  5.08,13.97 270 top
R1  23.5,79.38 270 top
R2  26.04,79.38 90 top
R3  36.83,64.14 180 top
R4  36.83,59.05 0 top
R5  44.45,59.69 0 top
R6  59.44,64.77 0 top
R7  32.38,61.59 180 top
R8  51.56,78.11 0 top
R9  47.75,78.11 0 top
R10  61.59,78.11 0 top
R11  18.67,15.24 270 top
R12  24,15.24 90 top
R13  25.91,21.34 270 top
R14  20.32,53.98 0 top
R15  19.68,46.35 0 top
R16  22.61,47.24 90 top
R17  16.51,53.98 0 top
R18  15.88,46.35 180 top
R19  10.67,13.21 90 top
R20  15.88,34.29 0 top
R21  15.88,29.21 180 top
R22  12.06,34.29 0 top
R23  12.06,29.21 180 top
R24  65.53,12.7 180 top
R25  35.56,10.16 0 top
R26  19.68,34.29 0 top
R27  19.68,29.21 180 top
R28  11.05,19.68 90 top
R29  13.34,13.34 0 top
R30  41.53,83.95 0 top
R31  54.61,76.58 270 top
R32  52.32,72.26 270 top
R33  67.06,64.77 180 top
R34  85.22,26.29 0 top
R35  75.95,82.3 270 top
SCL  59.18,61.21 0 top
SDA  67.82,61.21 0 top
STRING  -18.92,-8.64 0 top  (outside the outline)
TC-K  84.58,7.62 0 top
TP1  17.14,36.83 90 top
TP2  14.61,36.83 90 top
TP3  12.06,36.83 90 top
U1  22.23,69.85 270 top
U2  38.73,70.48 0 top
U3  66.55,77.34 270 top
U4  47.88,83.31 90 top
U5  87.63,15.88 0 top
U6  19.05,50.16 180 top
U7  17.78,22.23 0 top
U8  14.73,62.23 90 top
U9  86.61,33.02 270 top
U10  26.67,57.78 180 top
U11  83.82,74.3 90 top
U12  93.98,33.78 90 top
VPANEL  19.05,74.3 0 top
Y1  92.08,73.66 0 top

### Tracks (layer width: path | path; a pad name or v marks a point on that pad's centre or on a via)
!BATTCHARGING
  Top 0.254: U6.7 18.55,48.27 18.29,48.01 17.27,48.01 16.76,47.5 16.76,46.39 R18.1 16.76,46.32 16.76,45.47 17.53,44.7 22.61,44.7 25.4,41.91 A1.4
ACTIVITYLED  (via drill 0.6)
  Top 0.305: v30.73,13.21 34.29,13.21 36.32,11.18 36.32,10.25 R25.2
  Bottom 0.254: 31.75,20.83 31.75,27.94
  Bottom 0.305: 31.75,20.83 30.23,19.3 30.23,13.72 v30.73,13.21 | 31.75,27.94 A1.29
AMUXOUT  (via drill 0.6)
  Top 0.254: 31.75,40.64 26.16,40.64
  Top 0.305: 31.75,40.64 A1.24 34.71,41.91 C26.1 | 26.16,40.64 25.65,40.13 24.38,40.13 23.62,39.37 v22.61,38.35 | U7.3 D4.C 15.95,16.51 16.51,16.51 17.02,16 17.02,12.95 16.51,12.45 v16.51,12.19
  Bottom 0.305: v22.61,38.35 22.61,18.29 23.11,17.78 23.11,12.95 23.11,11.94 22.61,11.43 17.02,11.43 16.51,11.94 v16.51,12.19
AMUXS0
  Top 0.305: A1.5 26.67,39.37 22.61,35.31 22.61,29.21 21.59,28.19 21.34,27.94 20.07,27.94 19.68,27.56 U7.11
AMUXS1
  Top 0.254: 31.75,33.02 25.91,33.02
  Top 0.305: U7.10 20.95,26.54 21.34,26.92 22.35,26.92 24.38,28.96 24.38,31.5 25.65,32.77 25.91,33.02 | A1.27 31.75,33.02
AMUXS2
  Top 0.254: 31.75,30.48 27.88,30.48
  Top 0.305: A1.28 31.75,30.48 | 27.88,30.48 U7.9
BATTCHARGEENABLE  (via drill 0.6)
  Top 0.254: R14.1 19.55,53.9 U6.2 19.55,52.06 20.07,52.58 v20.57,52.58 | 61.21,33.02 74.93,33.02
  Top 0.305: v39.62,24.13 52.32,24.13 61.21,33.02 | 74.93,33.02 A1.13
  Bottom 0.254: v20.57,52.58 21.59,52.58 24.38,49.78 24.38,36.83 25.4,35.81 | 29.21,35.56 36.58,35.56
  Bottom 0.305: 25.4,35.81 28.96,35.81 29.21,35.56 | 36.58,35.56 38.1,34.04 38.1,25.65 v39.62,24.13
DAYSENSORSCALED
  Top 0.305: U7.13 17.14,22.48 17.27,22.35 23.88,22.35 24.13,22.1 24.13,20.83 24.38,20.57 25.82,20.57 R13.2 26.16,20.23 26.16,11.18 25.91,10.92 21.59,10.92 | R19.1 10.67,11.43 11.18,10.92 21.59,10.92 | PHOTOCELL.2 21.66,10.85 21.59,10.92
DISPLAYCS
  Top 0.254: 54.61,56.13 54.61,47.75 | 72.14,43.18 74.93,43.18
  Top 0.305: DISP1.OLEDCS 50.8,55.37 52.07,56.64 54.1,56.64 54.61,56.13 | 54.61,47.75 54.61,44.45 55.37,43.69 71.63,43.69 72.14,43.18 | 74.93,43.18 A1.18
DISPLAYDC  (via drill 0.6)
  Top 0.305: A1.30 v45.97,26.67 | v45.97,34.29 45.97,54.99 DISP1.OLEDDC
  Bottom 0.305: v45.97,26.67 v45.97,34.29
GATES  (via drill 0.6)
  Top 0.305: v10.16,78.74 14.48,78.74 19.05,83.31 35.56,83.31 36.2,83.95 R30.1
  Bottom 0.305: v10.16,78.74 8.38,78.74 | 8.38,78.74 8.13,78.99 8.13,86.61 7.87,86.87 5.19,86.87 Q1.3 | Q2.3 7.99,75.55 | 7.99,75.55 8.13,75.69 8.13,78.49 8.38,78.74 | Q3.3 7.99,64.12 | 7.99,64.12 8.13,64.26 8.13,75.41 7.99,75.55 | Q4.3 7.99,52.69 | 7.99,52.69 8.13,52.83 8.13,63.98 7.99,64.12 | Q5.3 7.99,41.26 | 7.99,41.26 8.13,41.4 8.13,52.55 7.99,52.69 | Q6.3 7.99,29.83 | 7.99,29.83 8.13,29.97 8.13,41.12 7.99,41.26 | Q7.3 7.99,18.4 8.13,18.54 | 8.13,18.54 8.13,29.69 7.99,29.83 | Q8.3 7.99,6.97 8.13,7.11 8.13,18.54
GND  (via drill 0.6)  (10 unrouted)
  Bottom 1.016: 33.27,46.99 35.56,46.99
  other vias: 46.99,68.58 46.99,75.18 46.99,71.88 44.7,89.92 46.74,89.92 12.45,74.68 14.73,74.68 59.18,75.69 58.42,73.66 42.16,70.61 42.16,66.29 36.83,50.55 36.83,48.51 36.83,45.97 13.97,30.48 17.78,30.48 21.84,73.66 23.37,73.66 34.29,73.66 31.75,68.58 31.75,66.8 23.62,60.45 15.75,51.56 26.92,48.51 26.92,45.97 28.45,18.54 28.45,16.76
  pour Top (rank 4): 1.27,1.27 1.27,97.79 97.79,97.79 97.79,1.27
  pour Bottom (rank 2): 1.27,1.27 1.27,97.79 97.79,97.79 97.79,1.27
I2C_SCL  (via drill 0.6)  (1 unrouted)
  Top 0.305: v35.05,30.48 53.59,30.48 55.37,32.26 56.39,33.27 v56.9,33.78 | R6.1 58.59,61.81 SCL.1 | U11.6 79.06,74.62 76.96,72.52 75.82,72.52 JP3.3
  Top 0.406: v70.36,78.49 70.36,77.72 69.98,77.34 U3.5
  Bottom 0.254: 31.75,30.48 v35.05,30.48 | 59.69,36.58 59.69,59.44
  Bottom 0.305: A1.9 31.75,30.48 | v56.9,33.78 59.69,36.58 | SCL.1 59.69,60.71 59.69,59.44 65.53,65.28 65.53,67.82 70.36,72.64 | 70.36,72.64 v70.36,78.49 | 70.36,72.64 JP3.3
I2C_SDA  (via drill 0.6)  (1 unrouted)
  Top 0.254: 31.75,27.94 53.34,27.94
  Top 0.305: A1.10 31.75,27.94 | 53.34,27.94 v56.13,30.73 | R33.1 67.91,61.3 SDA.1 | U11.5 75.78,75.27 JP3.4 74.48,76.39 U3.4 67.91,76.33
  Bottom 0.254: 62.23,53.85 62.23,59.69
  Bottom 0.305: v56.13,30.73 61.47,36.07 61.47,53.09 61.98,53.59 62.23,53.85 | JP3.4 76.07,75.18 79.12,72.14 79.12,63.37 76.83,61.09 67.94,61.09 SDA.1 63.75,61.21 62.23,59.69
IPANELSCALED
  Top 0.254: 31.75,48.26 31.75,52.32 31.5,52.58 31.5,61.56 R7.2
  Top 0.305: A1.2 31.75,48.26 | 31.75,61.38 R7.2
  Top 0.406: R7.2 31.54,63.78 D3.C
IRRECEIVER
  Top 0.305: U9.VOUT 93.98,35.56 U12.OUT
  Bottom 0.254: 74.93,30.48 81.53,30.48
  Bottom 0.305: A1.32 74.93,30.48 | 81.53,30.48 82.55,31.5 82.55,34.29 83.82,35.56 U9.VOUT
N$1
  Top 0.406: R30.2 U4.6 47.37,83.95 47.75,83.57 47.75,80.26 46.99,79.5 46.99,78.19 R9.1
N$2
  Top 0.305: U5.3 88.27,7.8 TC-K.2
N$3
  Top 0.406: C20.1 R31.2 54.61,73.38 D5.1 52.47,73.25 R32.1
N$4
  Top 0.406: U1.6 27.65,69.22 C1.1
N$5  (via drill 0.6)
  Top 0.406: U1.7 IPANEL.1 | v33.78,58.93 35.85,58.93 R4.1
  Bottom 0.406: IPANEL.1 33.66,59.05 v33.78,58.93
N$6
  Top 0.406: U2.2 38.1,64.56 R3.1 C5.2 R4.2
N$7
  Top 0.305: 43.69,59.6 43.69,60.71 41.91,62.48 41.4,62.99 39.88,62.99 39.79,62.9
  Top 0.406: U2.3 39.37,64.56 C8.1 39.79,62.9 39.37,62.48 39.37,59.59 D11.1 | 43.69,59.6 R5.1
N$8
  Top 0.406: R7.1 C5.1 R3.2 35.81,64.3 35.81,70.1 36.32,70.61 39.37,70.61 U2.6
N$9
  Top 0.406: U3.1 62.63,78.29 R10.2 62.45,75.78 DACOUT.1
N$10
  Top 0.406: R9.2 R8.1 50.8,78.19 50.8,79.25 51.31,79.76 52.32,80.77 52.32,82.04 51.69,82.68 U4.2
N$11
  Top 0.305: U5.2 87,11.56 84.58,9.14 TC-K.1
N$12
  Top 0.305: U4.3 51.69,83.95 53.34,82.3 53.34,80.26 54.61,78.99 | 54.61,78.99 R31.1 | R10.1 59.56,78.11 58.93,78.74 54.86,78.74 54.61,78.99
N$13
  Top 0.406: U11.1 88.03,73.32 Y1.1
N$14
  Top 0.254: U6.9 19.55,48.27 20.32,47.5 20.32,46.57 R15.2 22.57,46.35 R16.1
N$15
  Top 0.254: U6.8 19.05,46.57 R15.1
N$16
  Top 0.254: U6.3 19.05,52.28 R17.2
N$17
  Top 0.406: U11.2 88,73.97 Y1.4
N$18
  Top 0.406: U11.3 87.32,74.62 87.38,74.68 87.38,80.98 C25.+
N$19
  Top 0.406: R25.1 34.71,7.82 D10.A
N$20  (2 unrouted)
ONEWIRE
  Top 0.305: 66.67,13.97 66.38,13.68 R24.1 66.36,12.68 1WIRE.2
  Top 0.406: A1.11 76.2,14.61 75.56,13.97 66.67,13.97
PERIPHERALRESET  (via drill 0.6)  (1 unrouted)
  Top 0.305: A1.31 57.91,26.67 v56.9,25.65 | v48.51,34.8 48.51,54.99 DISP1.RESET | R35.2 75.95,77.98 JP3.5
  Bottom 0.305: v56.9,25.65 50.29,25.65 48.51,27.43 v48.51,34.8 | JP3.5 75.44,77.72 73.03,80.14 66.29,80.14 64.64,78.49 64.64,73.28 48.26,56.9 DISP1.RESET
SDCD
  Top 0.254: 77.72,45.72 59.69,45.72
  Top 0.305: A1.17 77.47,41.91 78.49,42.93 78.49,44.96 77.72,45.72 | 59.69,45.72 58.42,46.99 DISP1.SDCD
SDCS  (via drill 0.6)
  Top 0.305: v35.05,33.02 51.31,33.02 53.09,34.8 53.09,54.99 DISP1.SDCS
  Bottom 0.254: 31.75,33.02 v35.05,33.02
  Bottom 0.305: A1.8 31.75,33.02
SPI_CLK  (via drill 0.6)
  Top 0.254: 31.75,35.56 41.91,35.56
  Top 0.305: A1.7 31.75,35.56 | 41.91,35.56 43.18,36.83 | 43.18,36.83 DISP1.SCK | 43.18,36.83 44.2,36.83 v44.45,36.58 | v60.96,22.35 v66.8,22.35 | v89.66,21.59 89.66,18.6 U5.5
  Bottom 0.305: v44.45,36.58 50.8,36.58 51.31,36.07 51.31,31.24 54.61,27.94 58.67,27.94 60.2,26.42 60.2,23.11 v60.96,22.35 | v66.8,22.35 88.9,22.35 v89.66,21.59
SPI_MISO  (via drill 0.6)
  Top 0.254: 74.93,35.56 v56.13,35.56
  Top 0.305: 74.93,35.56 A1.14 78.23,34.29 81.53,30.99 81.53,23.62 83.06,22.1 86.36,22.1 87,21.46 U5.7
  Bottom 0.305: v56.13,35.56 56.13,54.99 DISP1.MISO
SPI_MOSI  (via drill 0.6)
  Top 0.254: 74.93,38.1 v54.61,38.1
  Top 0.305: A1.15 74.93,38.1 | v40.39,38.86 40.39,54.99 DISP1.MOSI
  Bottom 0.305: v54.61,38.1 41.15,38.1 v40.39,38.86
THERMOCOUPLECS
  Top 0.305: A1.19 79.5,46.99 81.53,44.96 81.53,34.04 83.06,32.51 83.06,28.7 83.06,26.29 | U5.6 88.39,18.6 88.39,23.37 87.38,24.38 83.44,24.38 83.06,24.77 83.06,26.29 | R34.1 83.06,26.29
V3.3  (via drill 0.6)  (1 unrouted)
  Top 0.305: v11.94,26.42 11.05,25.53 C21.1 13.31,24.85 U7.16 13.34,22.82 R28.2 10.38,20.54 9.65,19.81 9.65,17.27 10.67,16.26 R19.2 | v13.97,48.77 14.22,48.77 14.99,48.01 14.99,46.39 R18.2 | R6.2 63.5,64.77 R33.2 66.17,64.81 66.17,66.42 67.31,67.56 JP3.1 77.6,67.56 80.7,70.67 81.77,70.67 | U12.VCC 91.82,34.42 90.93,33.53 90.93,31.24 90.42,30.73 | 90.42,30.73 87.88,30.73 86.87,30.73 U9.VCC | C22.1 90.34,30.65 90.42,30.73 | R34.2 87.5,26.29 87.63,26.42
  Top 0.406: U11.8 81.77,70.67 C24.1 81.83,70.61 | R32.2 52.32,69.85 52.58,69.6 58.93,69.6 59.05,69.72 | 59.05,69.72 60.2,70.87 60.2,73.66 60.71,74.17 64.01,74.17 64.22,74.38 C6.1 65.25,74.41 U3.3 | 63.5,57.4 63.5,64.77 63.5,65.28 59.05,69.72 | v13.97,48.77 13.97,52.32 13.72,52.58 13.72,56.64 15.24,58.17 15.24,61.47 16,62.23 U8.2 | R24.2 64.68,5.17 64.77,5.08 69.34,5.08 69.85,5.59 69.85,7.61 1WIRE.3 73.44,7.62 C23.1 74.21,7.41 82.8,16 87.63,16 91.19,16 | 91.19,16 91.69,16.51 91.69,22.35 87.63,26.42 87.63,29.46 U9.VCC | 91.19,16 91.19,13.5 | 91.19,13.5 C9.1 | 91.19,13.5 89.76,13.5 U5.4
  Top 0.61: U8.2 20.76,62.23 C17.1 v22.67,62.16 | v33.78,57.4 38.61,57.4 39.12,57.4 63.25,57.4 63.5,57.4 DISP1.VIN
  Bottom 0.305: v11.94,26.42 11.94,37.59 10.67,38.86 10.67,45.47 v13.97,48.77
  Bottom 0.61: v22.67,62.16 25.21,62.16 29.97,57.4 30.73,57.4 | 30.73,57.4 v33.78,57.4 | A1.1 30.48,57.15 30.73,57.4 | DISP1.VIN 63.5,18.29 69.85,11.94 69.85,7.63 1WIRE.3
V3P3SCALED
  Top 0.305: R28.1 13.3,18.84 13.34,18.8
  Top 0.406: U7.1 13.34,18.8 13.34,17.78 13.97,17.14 13.97,16.09 C14.1 R29.2
V5SW  (via drill 0.6)
  Top 0.305: v22.67,54.04 26.04,54.04 C19.1 26.67,53.41 26.67,54.61 27.62,55.56 U10.5 | v18.8,12.45 18.8,14.26 R11.2
  Top 0.406: U1.8 25.4,71.86 C4.1 30.77,73.44 32.77,75.44 37.59,75.44 38.1,74.93 | U2.7 38.1,74.93 | R5.2 45.3,62.44 C3.1 44.03,62.65 43.69,62.99 43.69,73.41 41.66,75.44 38.61,75.44 38.1,74.93 | 25.43,71.63 U1.8 | U1.8 27.05,71.75 v27.18,71.63
  Bottom 0.305: 19.56,54.04 14.67,54.04 9.91,49.28 9.91,19.05 10.67,18.29 11.43,17.53 17.27,17.53 17.53,17.27 17.53,12.95 18.03,12.45 v18.8,12.45
  Bottom 0.406: v27.18,71.63 27.18,67.06 26.16,66.04 24.38,66.04 19.81,66.04 19.56,65.79 19.56,54.04 v22.67,54.04
V5SWENABLE  (via drill 0.6)
  Top 0.305: A1.3 24.89,44.45 24.38,44.96 v24.38,52.07 | v24.38,55.37 24.38,58.67 24.89,59.18 25.63,59.18 U10.3
  Bottom 0.305: v24.38,52.07 v24.38,55.37
V5SWSCALED
  Top 0.305: U7.5 18.41,16.34 R11.1 C10.1 R12.2
VBATT1
  Top 0.406: BATT.3 17.14,41.27 TP1.TP 17.14,34.71 R20.2
VBATT1SCALED
  Top 0.406: R20.1 C11.1 R21.2 15.24,29 15.24,27.94 15.88,27.3 U7.14
VBATT2
  Top 0.406: BATT.2 14.61,41.27 TP2.TP 14.61,35.98 R22.2
VBATT2SCALED
  Top 0.406: R22.1 C12.1 R23.2 11.21,28.16 11.81,27.56 13.72,27.56 14.61,26.67 U7.15
VBATT3  (via drill 0.6)
  Top 0.305: U4.7 44.83,82.68 | v29.97,75.18 32.26,77.47 41.91,77.47 42.42,77.98 42.42,81.37 C7.1 | v29.21,65.02 28.7,65.02 27.43,63.75
  Top 0.406: BATT.1 12.06,41.27 TP3.TP | R26.2 20.54,35.98 v20.32,36.2 | U8.3 20.93,64.53 C16.1 26.63,64.56 27.43,63.75 27.43,61.68 C18.1 27.62,61.32 U10.1 | U4.7 43.65,82.68 C7.1
  Top 1.016: U8.3 14.75,64.53 13.97,63.75 13.97,59.94 13.97,58.93 12.19,57.15 12.19,41.34 BATT.1
  Bottom 0.305: v20.32,36.2 17.2,36.2 BATT.1 | v29.97,75.18 29.97,65.79 v29.21,65.02
  Bottom 0.813: BATT.1 12.12,45.15 13.21,46.23 21.84,46.23 22.35,46.74 22.35,49.53 v22.61,49.78
  pour Top (rank 2, no thermals): 19.88,49.15 21.97,49.15 21.97,50.55 23.3,50.55 23.3,47.24 21.91,47.24 21.91,48.39 19.88,48.39
VBATT3SCALED
  Top 0.406: R26.1 C13.1 R27.2 18.41,28.79 U7.12
VPANEL0
  pour Bottom: 11.18,82.3 23.88,82.3 26.16,84.58 26.16,88.14 20.07,88.14 18.29,86.36 10.92,86.36 10.41,85.85 10.41,83.06
VPANEL1
  Top 0.406: R1.2 21.12,78.53 20.07,77.47 19.12,77.47 D1.C VPANEL.1 19.05,71.86 U1.1
  pour Top: 11.18,72.64 20.57,72.64 20.83,72.39 20.83,70.36 20.57,70.1 17.53,70.1 16.76,68.83 11.18,68.83 10.16,69.34 10.16,72.39
  pour Top (no thermals): 17.53,72.64 17.53,70.1 20.83,70.1 20.83,72.39 20.57,72.64
VPANEL2  (via drill 0.6)  (2 unrouted)
  Top 0.254: 21.08,53.89 R14.2
  Top 0.305: 21.8,51.52 21.84,51.56 | 8.95,56.19 Q4.2
  Top 0.406: 21.84,51.56 21.84,53.3 R14.2 21.17,55.37 C15.1 21.17,57.57 20.57,58.17 17.78,58.17 v17.27,57.66 | v10.92,58.17 8.95,56.19
  Bottom 0.406: v17.27,57.66 11.43,57.66 v10.92,58.17
  pour Top (rank 2): 7.37,4.83 3.3,4.83 3.3,92.2 6.86,92.2 9.65,68.33 17.02,68.33 17.78,69.47 20.83,69.47 20.83,67.56 20.57,67.31 19.56,67.31 18.8,65.79 10.41,65.28
  pour Top (no thermals): 17.78,69.47 20.83,69.47 20.83,67.31 17.78,67.31
  pour Top (no thermals): 19.94,51.69 19.94,51.94 21.97,51.94 21.97,51.31 21.97,51.18 19.94,51.18
VPANELSCALED  (via drill 0.6)
  Top 0.305: v35.81,79.25 34.49,80.58 D2.C
  Top 0.406: D2.C 28.93,80.58 C2.1 R2.2 R1.1
  Bottom 0.254: 31.75,38.1 34.29,38.1
  Bottom 0.305: A1.6 31.75,38.1 | 34.29,38.1 34.29,38.35 38.35,42.42 38.35,76.71 v35.81,79.25

### Text on the board
tPlace: + | - | SolOhm | V0.1 / 150101 | RST / / SDA / / SCL / / GND / / 3.3 | S | GND | VCC | D | G
tNames: POWER